# Altium project XMS0004.PrjPcb (part 2 of 3)

## Sheet ADC.SchDoc: xcore.ai Multi Channel Audio
size 408 x 287 mm; DocumentNumber: 4; Revision: 1V1; SheetNumber: 4; SheetTotal: 8
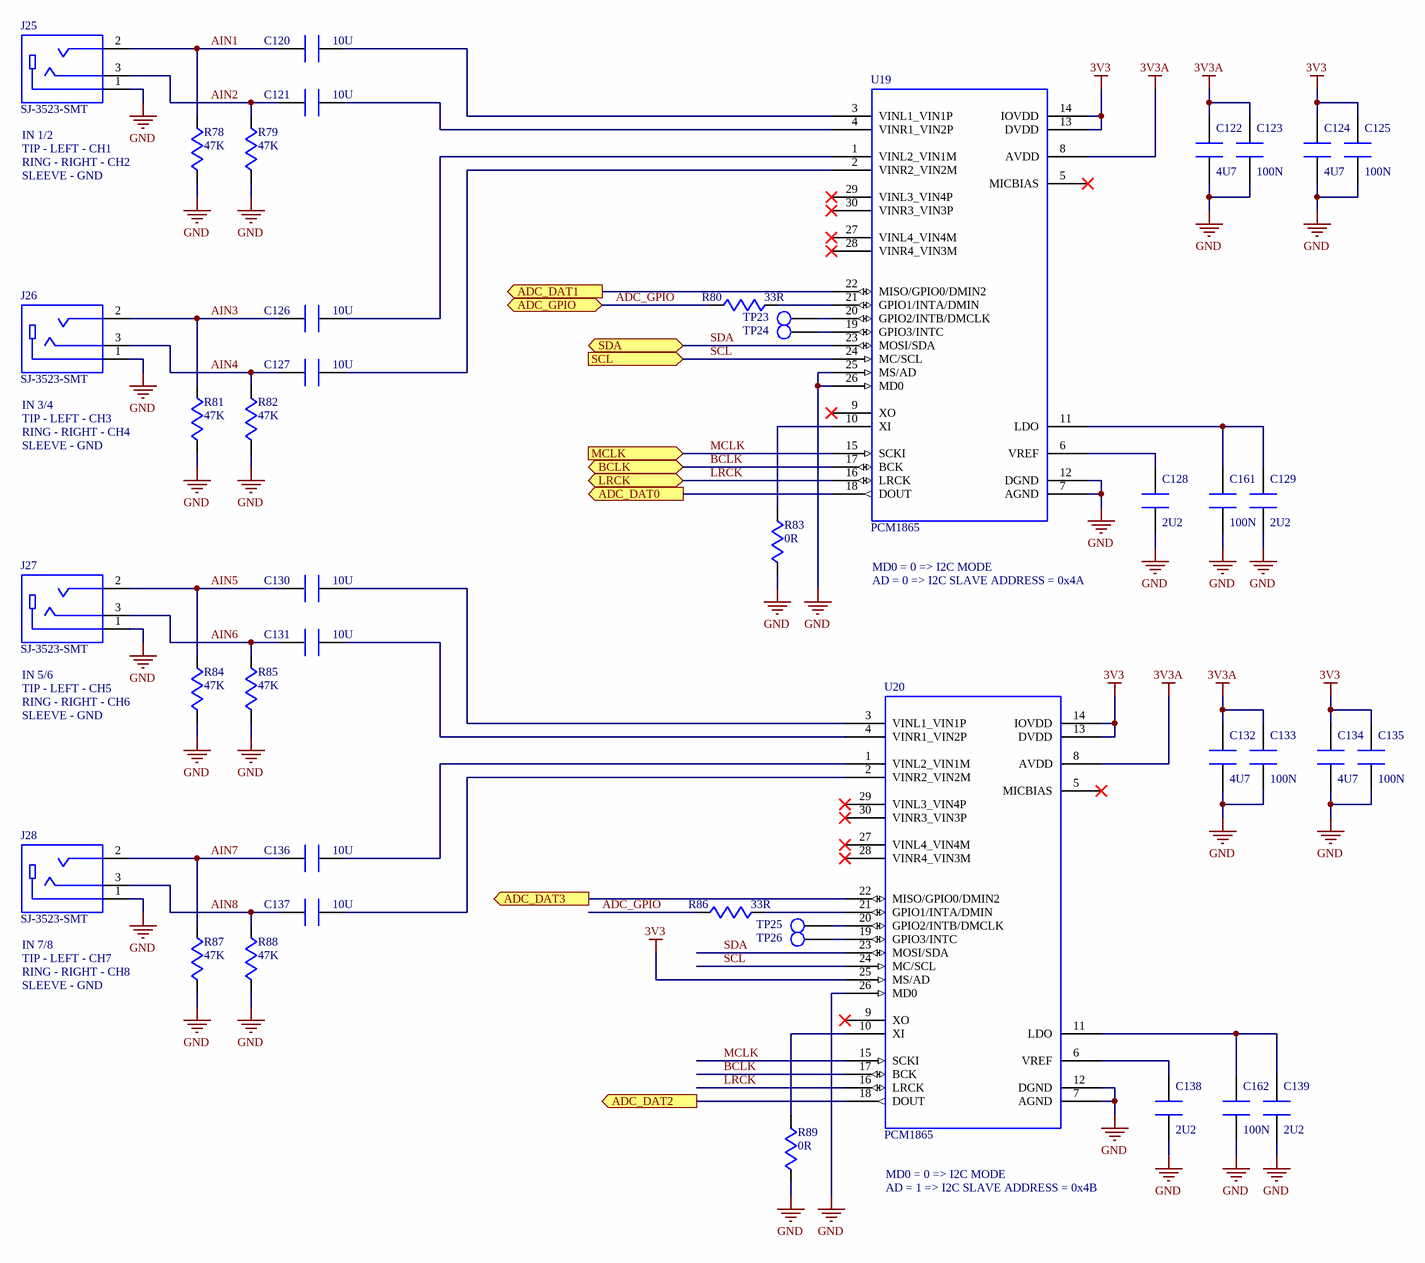
[diagram p4: ADC.SchDoc]

### Parts
C120  10U  [CAPC2012X145N]
C121  10U  [CAPC2012X145N]
C122  4U7  [CAPC1608X90N]
C123  100N  [CAPC1005X55N]
C124  4U7  [CAPC1608X90N]
C125  100N  [CAPC1005X55N]
C126  10U  [CAPC2012X145N]
C127  10U  [CAPC2012X145N]
C128  2U2  [CAPC1608X90N]
C129  2U2  [CAPC1608X90N]
C130  10U  [CAPC2012X145N]
C131  10U  [CAPC2012X145N]
C132  4U7  [CAPC1608X90N]
C133  100N  [CAPC1005X55N]
C134  4U7  [CAPC1608X90N]
C135  100N  [CAPC1005X55N]
C136  10U  [CAPC2012X145N]
C137  10U  [CAPC2012X145N]
C138  2U2  [CAPC1608X90N]
C139  2U2  [CAPC1608X90N]
C161  100N  [CAPC1005X55N]
C162  100N  [CAPC1005X55N]
J25  SJ-3523-SMT  [CON_CUI_SJ3523]
J26  SJ-3523-SMT  [CON_CUI_SJ3523]
J27  SJ-3523-SMT  [CON_CUI_SJ3523]
J28  SJ-3523-SMT  [CON_CUI_SJ3523]
R78  47K  [RESC1608X55N]
R79  47K  [RESC1608X55N]
R80  33R  [RESC1608X55N]
R81  47K  [RESC1608X55N]
R82  47K  [RESC1608X55N]
R83  0R  [RESC1608X55N]
R84  47K  [RESC1608X55N]
R85  47K  [RESC1608X55N]
R86  33R  [RESC1608X55N]
R87  47K  [RESC1608X55N]
R88  47K  [RESC1608X55N]
R89  0R  [RESC1608X55N]
TP23  TESTPOINT  [TESTPOINT_SMD_1MM]  (value not drawn)  (no BOM)
TP24  TESTPOINT  [TESTPOINT_SMD_1MM]  (value not drawn)  (no BOM)
TP25  TESTPOINT  [TESTPOINT_SMD_1MM]  (value not drawn)  (no BOM)
TP26  TESTPOINT  [TESTPOINT_SMD_1MM]  (value not drawn)  (no BOM)
U19  PCM1865  [SOP30P50_780X640X120L62X20N]
U20  PCM1865  [SOP30P50_780X640X120L62X20N]

### Ports
ADC_DAT0 (out), ADC_DAT1 (out), ADC_DAT2 (out), ADC_DAT3 (out), ADC_GPIO (bidir), BCLK (bidir), LRCK (bidir), MCLK (in), SCL (in), SDA (bidir)

### Nets
3V3: C124.1 C125.1 C134.1 C135.1 U19.13(DVDD) U19.14(IOVDD) U20.13(DVDD) U20.14(IOVDD) U20.25(MS/AD)
3V3A: C122.1 C123.1 C132.1 C133.1 U19.8(AVDD) U20.8(AVDD)
GND: C122.2 C123.2 C124.2 C125.2 C128.2 C129.2 C132.2 C133.2 C134.2 C135.2 C138.2 C139.2 C161.2 C162.2 J25.1 J26.1 J27.1 J28.1 R78.1 R79.1 R81.1 R82.1 R83.2 R84.1 R85.1 R87.1 R88.1 R89.2 U19.7(AGND) U19.12(DGND) U19.25(MS/AD) U19.26(MD0) U20.7(AGND) U20.12(DGND) U20.26(MD0)
ADC_D0: U19.18(DOUT) ; port ADC_DAT0
ADC_D1: U19.22(MISO/GPIO0/DMIN2) ; port ADC_DAT1
ADC_D2: U20.18(DOUT) ; port ADC_DAT2
ADC_D3: U20.22(MISO/GPIO0/DMIN2) ; port ADC_DAT3
ADC_GPIO: R80.1 R86.1 ; port ADC_GPIO
AIN1: C120.1 J25.2 R78.2
AIN2: C121.1 J25.3 R79.2
AIN3: C126.1 J26.2 R81.2
AIN4: C127.1 J26.3 R82.2
AIN5: C130.1 J27.2 R84.2
AIN6: C131.1 J27.3 R85.2
AIN7: C136.1 J28.2 R87.2
AIN8: C137.1 J28.3 R88.2
BCLK: U19.17(BCK) U20.17(BCK) ; port BCLK
LRCK: U19.16(LRCK) U20.16(LRCK) ; port LRCK
MCLK: U19.15(SCKI) U20.15(SCKI) ; port MCLK  [project net MCLK_ADC]
SCL: U19.24(MC/SCL) U20.24(MC/SCL) ; port SCL  [project net I2C0_SCL]
SDA: U19.23(MOSI/SDA) U20.23(MOSI/SDA) ; port SDA  [project net I2C0_SDA]
NetC120_2: C120.2 U19.3(VINL1_VIN1P)
NetC121_2: C121.2 U19.4(VINR1_VIN2P)
NetC126_2: C126.2 U19.1(VINL2_VIN1M)
NetC127_2: C127.2 U19.2(VINR2_VIN2M)
NetC128_1: C128.1 U19.6(VREF)
NetC129_1: C129.1 C161.1 U19.11(LDO)
NetC130_2: C130.2 U20.3(VINL1_VIN1P)
NetC131_2: C131.2 U20.4(VINR1_VIN2P)
NetC136_2: C136.2 U20.1(VINL2_VIN1M)
NetC137_2: C137.2 U20.2(VINR2_VIN2M)
NetC138_1: C138.1 U20.6(VREF)
NetC139_1: C139.1 C162.1 U20.11(LDO)
NetR80_2: R80.2 U19.21(GPIO1/INTA/DMIN)
NetR83_1: R83.1 U19.10(XI)
NetR86_2: R86.2 U20.21(GPIO1/INTA/DMIN)
NetR89_1: R89.1 U20.10(XI)
NetTP23_1: TP23.1 U19.20(GPIO2/INTB/DMCLK)
NetTP24_1: TP24.1 U19.19(GPIO3/INTC)
NetTP25_1: TP25.1 U20.20(GPIO2/INTB/DMCLK)
NetTP26_1: TP26.1 U20.19(GPIO3/INTC)

Not connected (* = marked no-connect by the designer): U19 5(MICBIAS)* 9(XO)* 27(VINL4_VIN4M)* 28(VINR4_VIN3M)* 29(VINL3_VIN4P)* 30(VINR3_VIN3P)*; U20 5(MICBIAS)* 9(XO)* 27(VINL4_VIN4M)* 28(VINR4_VIN3M)* 29(VINL3_VIN4P)* 30(VINR3_VIN3P)*

### Notes on the sheet
- IN 1/2
- TIP - LEFT - CH1
- RING - RIGHT - CH2
- SLEEVE - GND
- IN 3/4
- TIP - LEFT - CH3
- RING - RIGHT - CH4
- AD = 0 => I2C SLAVE ADDRESS = 0x4A
- MD0 = 0 => I2C MODE
- IN 5/6
- TIP - LEFT - CH5
- RING - RIGHT - CH6
- IN 7/8
- TIP - LEFT - CH7
- RING - RIGHT - CH8
- AD = 1 => I2C SLAVE ADDRESS = 0x4B
- Project Name
- Build
- Sheet Name
- Rev
- Date
- Sheet
- of

### Library data of the parts
C120 C121 C126 C127 C130 C131 C136 C137 = GEN-03-0048: CHIP CAPACITOR, CERAMIC, 10UF, 10V, 20%, X7R, 0805; Manufacturer: Murata; Manufacturer Part Number: GRM21BR71A106MA73L; Approx Volume Cost ($): 0.04; VALUE: 10U; Part Number: GEN-03-0048; Dielectric: X7R; Rated Voltage: 10V; Tolerance: 20%; Web Search Link: http://www.google.com/search?q=GRM21BR71A106MA73L
C122 C124 C132 C134 = STD-06-0151: CHIP CAPACITOR, CERAMIC, 4.7UF, 16V, 10%, X5R, 0603; Manufacturer: Murata; Manufacturer Part Number: GRM188R61C475KE11D; Approx Volume Cost ($): 0.084; VALUE: 4U7; Part Number: STD-06-0151; Dielectric: X5R; Rated Voltage: 16V; Tolerance: 10%; Web Search Link: http://www.google.com/search?q=GRM188R61C475KE11D
C123 C125 C133 C135 C161 C162 = STD-06-0048: as C62 on sheet Top Level; VALUE: 100N; Part Number: STD-06-0048; Dielectric: X7R; Rated Voltage: 16V; Tolerance: 10%; Web Search Link: http://www.google.com/search?q=CC0402KRX7R7BB104
C128 C129 C138 C139 = STD-06-0152: CHIP CAPACITOR, CERAMIC, 2.2UF, 16V, 10%, X5R, 0603; Manufacturer: Yageo; Manufacturer Part Number: CC0603KRX5R7BB225; Approx Volume Cost ($): 0.033; VALUE: 2U2; Part Number: STD-06-0152; Dielectric: X5R; Rated Voltage: 16V; Tolerance: 10%; Web Search Link: http://www.google.com/search?q=CC0603KRX5R7BB225
J25-J28 = GEN-01-0021: TRS jack, 3.5mm, SMD; Manufacturer: CUI; Approx Volume Cost ($): 0.51; VALUE: SJ-3523-SMT; Part Number: GEN-01-0021; Manufacturer Part Number: SJ-3523-SMT; Web Search Link: http://www.google.com/search?q=SJ-3523-SMT
R78 R79 R81 R82 R84 R85 R87 R88 = STD-02-0102: CHIP RESISTOR, 47K OHM, 0.1W, 1%, 0603; Manufacturer: Yageo; Manufacturer Part Number: RC0603FR-0747KL; Max Voltage: 50V; Max Power: 100mW; Temperature Coefficient: ±100ppm/°C; Approx Volume Cost ($): 0.002; VALUE: 47K; Part Number: STD-02-0102; Tolerance: 1%; Web Search Link: http://www.google.com/search?q=RC0603FR-0747KL
R80 R86 = STD-02-0026: as R12 on sheet Top Level; VALUE: 33R; Part Number: STD-02-0026; Tolerance: 1%; Web Search Link: http://www.google.com/search?q=RC0603FR-0733RL
R83 R89 = STD-02-0001: as R118 on sheet Top Level; VALUE: 0R; Part Number: STD-02-0001; Max Power: NA; Temperature Coefficient: NA; Web Search Link: http://www.google.com/search?q=RC0603JR-070RL
TP23-TP26 = GEN-24-0003: Testpoint, SMD, 1mm; Manufacturer: NA; VALUE: TESTPOINT; Part Number: GEN-24-0003; Manufacturer Part Number: NA; Approx Volume Cost ($): NA
U19 U20 = GEN-06-0022: Audio ADC, 4-Channel, 24 bit/192kHz, Single Ended or Differential, 110dB SNR, I2C/SPI Control, TSSOP30; Manufacturer: Texas Instruments; Manufacturer Part Number: PCM1865DBTR; Approx Volume Cost ($): 4; VALUE: PCM1865; Part Number: GEN-06-0022; Web Search Link: http://www.google.com/search?q=PCM1865

## Sheet DAC.SchDoc: xcore.ai Multi Channel Audio
size 408 x 287 mm; DocumentNumber: 3; Revision: 1V1; SheetNumber: 3; SheetTotal: 8
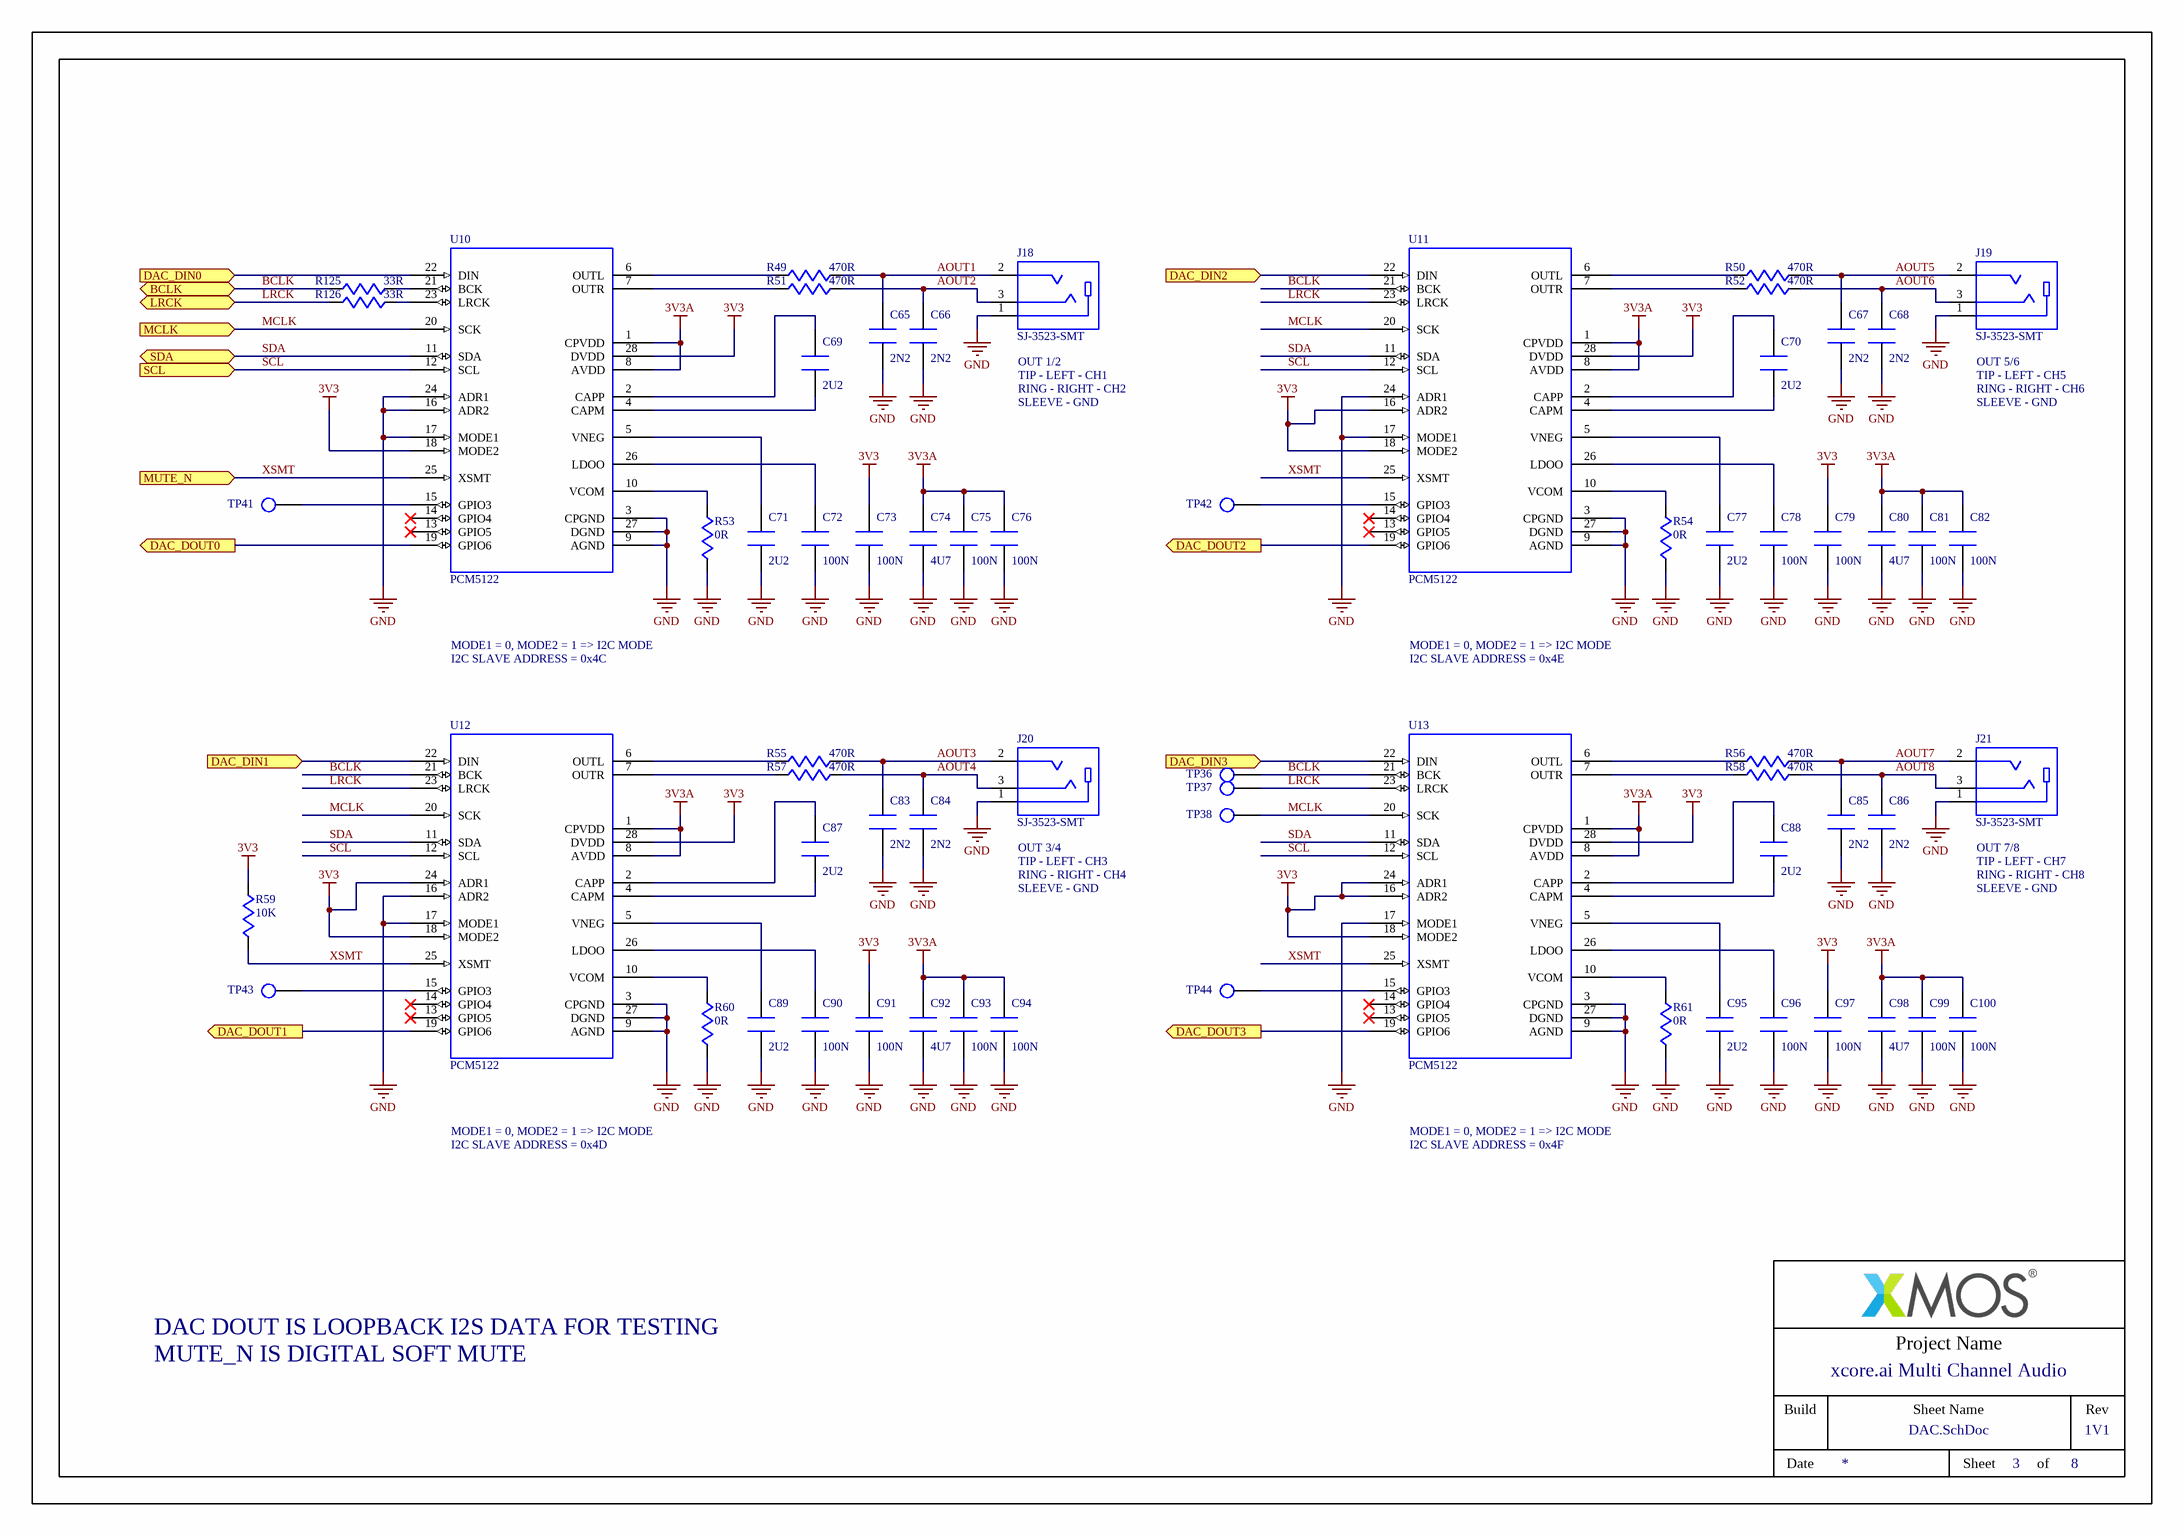
[diagram p5: DAC.SchDoc]

### Parts
C65  2N2  [CAPC1608X90N]
C66  2N2  [CAPC1608X90N]
C67  2N2  [CAPC1608X90N]
C68  2N2  [CAPC1608X90N]
C69  2U2  [CAPC1608X90N]
C70  2U2  [CAPC1608X90N]
C71  2U2  [CAPC1608X90N]
C72  100N  [CAPC1005X55N]
C73  100N  [CAPC1005X55N]
C74  4U7  [CAPC1608X90N]
C75  100N  [CAPC1005X55N]
C76  100N  [CAPC1005X55N]
C77  2U2  [CAPC1608X90N]
C78  100N  [CAPC1005X55N]
C79  100N  [CAPC1005X55N]
C80  4U7  [CAPC1608X90N]
C81  100N  [CAPC1005X55N]
C82  100N  [CAPC1005X55N]
C83  2N2  [CAPC1608X90N]
C84  2N2  [CAPC1608X90N]
C85  2N2  [CAPC1608X90N]
C86  2N2  [CAPC1608X90N]
C87  2U2  [CAPC1608X90N]
C88  2U2  [CAPC1608X90N]
C89  2U2  [CAPC1608X90N]
C90  100N  [CAPC1005X55N]
C91  100N  [CAPC1005X55N]
C92  4U7  [CAPC1608X90N]
C93  100N  [CAPC1005X55N]
C94  100N  [CAPC1005X55N]
C95  2U2  [CAPC1608X90N]
C96  100N  [CAPC1005X55N]
C97  100N  [CAPC1005X55N]
C98  4U7  [CAPC1608X90N]
C99  100N  [CAPC1005X55N]
C100  100N  [CAPC1005X55N]
J18  SJ-3523-SMT  [CON_CUI_SJ3523]
J19  SJ-3523-SMT  [CON_CUI_SJ3523]
J20  SJ-3523-SMT  [CON_CUI_SJ3523]
J21  SJ-3523-SMT  [CON_CUI_SJ3523]
R49  470R  [RESC1608X55N]
R50  470R  [RESC1608X55N]
R51  470R  [RESC1608X55N]
R52  470R  [RESC1608X55N]
R53  0R  [RESC1608X55N]
R54  0R  [RESC1608X55N]
R55  470R  [RESC1608X55N]
R56  470R  [RESC1608X55N]
R57  470R  [RESC1608X55N]
R58  470R  [RESC1608X55N]
R59  10K  [RESC1608X55N]
R60  0R  [RESC1608X55N]
R61  0R  [RESC1608X55N]
R125  33R  [RESC1608X55N]
R126  33R  [RESC1608X55N]
TP36  TESTPOINT  [TESTPOINT_SMD_0.9MM_L]  (value not drawn)  (no BOM)
TP37  TESTPOINT  [TESTPOINT_SMD_0.9MM_L]  (value not drawn)  (no BOM)
TP38  TESTPOINT  [TESTPOINT_SMD_0.9MM_L]  (value not drawn)  (no BOM)
TP41  TESTPOINT  [TESTPOINT_SMD_0.9MM_L]  (value not drawn)  (no BOM)
TP42  TESTPOINT  [TESTPOINT_SMD_0.9MM_L]  (value not drawn)  (no BOM)
TP43  TESTPOINT  [TESTPOINT_SMD_0.9MM_L]  (value not drawn)  (no BOM)
TP44  TESTPOINT  [TESTPOINT_SMD_0.9MM_L]  (value not drawn)  (no BOM)
U10  PCM5122  [SOP65P640X120-28N]
U11  PCM5122  [SOP65P640X120-28N]
U12  PCM5122  [SOP65P640X120-28N]
U13  PCM5122  [SOP65P640X120-28N]

### Ports
BCLK (bidir), DAC_DIN0 (in), DAC_DIN1 (in), DAC_DIN2 (in), DAC_DIN3 (in), DAC_DOUT0 (out), DAC_DOUT1 (out), DAC_DOUT2 (out), DAC_DOUT3 (out), LRCK (bidir), MCLK (in), MUTE_N (in), SCL (in), SDA (bidir)

### Nets
3V3: C73.1 C79.1 C91.1 C97.1 R59.2 U10.18(MODE2) U10.28(DVDD) U11.16(ADR2) U11.18(MODE2) U11.28(DVDD) U12.18(MODE2) U12.24(ADR1) U12.28(DVDD) U13.16(ADR2) U13.18(MODE2) U13.24(ADR1) U13.28(DVDD)
3V3A: C74.1 C75.1 C76.1 C80.1 C81.1 C82.1 C92.1 C93.1 C94.1 C98.1 C99.1 C100.1 U10.1(CPVDD) U10.8(AVDD) U11.1(CPVDD) U11.8(AVDD) U12.1(CPVDD) U12.8(AVDD) U13.1(CPVDD) U13.8(AVDD)
GND: C65.2 C66.2 C67.2 C68.2 C71.2 C72.2 C73.2 C74.2 C75.2 C76.2 C77.2 C78.2 C79.2 C80.2 C81.2 C82.2 C83.2 C84.2 C85.2 C86.2 C89.2 C90.2 C91.2 C92.2 C93.2 C94.2 C95.2 C96.2 C97.2 C98.2 C99.2 C100.2 J18.1 J19.1 J20.1 J21.1 R53.1 R54.1 R60.1 R61.1 U10.3(CPGND) U10.9(AGND) U10.16(ADR2) U10.17(MODE1) U10.24(ADR1) U10.27(DGND) U11.3(CPGND) U11.9(AGND) U11.17(MODE1) U11.24(ADR1) U11.27(DGND) U12.3(CPGND) U12.9(AGND) U12.16(ADR2) U12.17(MODE1) U12.27(DGND) U13.3(CPGND) U13.9(AGND) U13.17(MODE1) U13.27(DGND)
AOUT1: C65.1 J18.2 R49.2
AOUT2: C66.1 J18.3 R51.2
AOUT3: C83.1 J20.2 R55.2
AOUT4: C84.1 J20.3 R57.2
AOUT5: C67.1 J19.2 R50.2
AOUT6: C68.1 J19.3 R52.2
AOUT7: C85.1 J21.2 R56.2
AOUT8: C86.1 J21.3 R58.2
BCLK: R125.1 TP36.1 U11.21(BCK) U12.21(BCK) U13.21(BCK) ; port BCLK
DAC_D0: U10.22(DIN) ; port DAC_DIN0
DAC_D1: U12.22(DIN) ; port DAC_DIN1
DAC_D2: U11.22(DIN) ; port DAC_DIN2
DAC_D3: U13.22(DIN) ; port DAC_DIN3
I2S_DAC_LOOP_D0: U10.19(GPIO6) ; port DAC_DOUT0
I2S_DAC_LOOP_D1: U12.19(GPIO6) ; port DAC_DOUT1
I2S_DAC_LOOP_D2: U11.19(GPIO6) ; port DAC_DOUT2
I2S_DAC_LOOP_D3: U13.19(GPIO6) ; port DAC_DOUT3
LRCK: R126.1 TP37.1 U11.23(LRCK) U12.23(LRCK) U13.23(LRCK) ; port LRCK
MCLK: TP38.1 U10.20(SCK) U11.20(SCK) U12.20(SCK) U13.20(SCK) ; port MCLK  [project net MCLK_DAC]
SCL: U10.12(SCL) U11.12(SCL) U12.12(SCL) U13.12(SCL) ; port SCL  [project net I2C0_SCL]
SDA: U10.11(SDA) U11.11(SDA) U12.11(SDA) U13.11(SDA) ; port SDA  [project net I2C0_SDA]
XSMT: R59.1 U10.25(XSMT) U11.25(XSMT) U12.25(XSMT) U13.25(XSMT) ; port MUTE_N  [project net DAC_MUTE_N]
NetC69_1: C69.1 U10.2(CAPP)
NetC69_2: C69.2 U10.4(CAPM)
NetC70_1: C70.1 U11.2(CAPP)
NetC70_2: C70.2 U11.4(CAPM)
NetC71_1: C71.1 U10.5(VNEG)
NetC72_1: C72.1 U10.26(LDOO)
NetC77_1: C77.1 U11.5(VNEG)
NetC78_1: C78.1 U11.26(LDOO)
NetC87_1: C87.1 U12.2(CAPP)
NetC87_2: C87.2 U12.4(CAPM)
NetC88_1: C88.1 U13.2(CAPP)
NetC88_2: C88.2 U13.4(CAPM)
NetC89_1: C89.1 U12.5(VNEG)
NetC90_1: C90.1 U12.26(LDOO)
NetC95_1: C95.1 U13.5(VNEG)
NetC96_1: C96.1 U13.26(LDOO)
NetR49_1: R49.1 U10.6(OUTL)
NetR50_1: R50.1 U11.6(OUTL)
NetR51_1: R51.1 U10.7(OUTR)
NetR52_1: R52.1 U11.7(OUTR)
NetR53_2: R53.2 U10.10(VCOM)
NetR54_2: R54.2 U11.10(VCOM)
NetR55_1: R55.1 U12.6(OUTL)
NetR56_1: R56.1 U13.6(OUTL)
NetR57_1: R57.1 U12.7(OUTR)
NetR58_1: R58.1 U13.7(OUTR)
NetR60_2: R60.2 U12.10(VCOM)
NetR61_2: R61.2 U13.10(VCOM)
NetR125_2: R125.2 U10.21(BCK)
NetR126_2: R126.2 U10.23(LRCK)
NetTP41_1: TP41.1 U10.15(GPIO3)
NetTP42_1: TP42.1 U11.15(GPIO3)
NetTP43_1: TP43.1 U12.15(GPIO3)
NetTP44_1: TP44.1 U13.15(GPIO3)

Not connected (* = marked no-connect by the designer): U10 13(GPIO5)* 14(GPIO4)*; U11 13(GPIO5)* 14(GPIO4)*; U12 13(GPIO5)* 14(GPIO4)*; U13 13(GPIO5)* 14(GPIO4)*

### Notes on the sheet
- (near J18) OUT 1/2
- TIP - LEFT - CH1
- RING - RIGHT - CH2
- SLEEVE - GND
- (near J19) OUT 5/6
- TIP - LEFT - CH5
- RING - RIGHT - CH6
- I2C SLAVE ADDRESS = 0x4C
- MODE1 = 0, MODE2 = 1 => I2C MODE
- I2C SLAVE ADDRESS = 0x4E
- (near J20) OUT 3/4
- TIP - LEFT - CH3
- RING - RIGHT - CH4
- (near J21) OUT 7/8
- TIP - LEFT - CH7
- RING - RIGHT - CH8
- I2C SLAVE ADDRESS = 0x4D
- I2C SLAVE ADDRESS = 0x4F
- DAC DOUT IS LOOPBACK I2S DATA FOR TESTING
- MUTE_N IS DIGITAL SOFT MUTE
- Project Name
- Build
- Sheet Name
- Rev
- Date
- Sheet
- of

### Library data of the parts
C65-C68 C83-C86 = STD-06-0063: CHIP CAPACITOR, CERAMIC, 2.2NF, 50V, 5%, NP0, 0603; Manufacturer: Murata; Manufacturer Part Number: GRM1885C1H222JA01D; Approx Volume Cost ($): 0.01; VALUE: 2N2; Part Number: STD-06-0063; Dielectric: NP0; Rated Voltage: 50V; Tolerance: 5%; Web Search Link: http://www.google.com/search?q=GRM1885C1H222JA01D
C69-C71 C77 C87-C89 C95 = STD-06-0152: as C128 on sheet ADC; VALUE: 2U2; Part Number: STD-06-0152; Dielectric: X5R; Rated Voltage: 16V; Tolerance: 10%; Web Search Link: http://www.google.com/search?q=CC0603KRX5R7BB225
C72 C73 C75 C76 C78 C79 C81 C82 C90 C91 C93 C94 C96 C97 C99 C100 = STD-06-0048: as C62 on sheet Top Level; VALUE: 100N; Part Number: STD-06-0048; Dielectric: X7R; Rated Voltage: 16V; Tolerance: 10%; Web Search Link: http://www.google.com/search?q=CC0402KRX7R7BB104
C74 C80 C92 C98 = STD-06-0151: as C122 on sheet ADC; VALUE: 4U7; Part Number: STD-06-0151; Dielectric: X5R; Rated Voltage: 16V; Tolerance: 10%; Web Search Link: http://www.google.com/search?q=GRM188R61C475KE11D
J18-J21 = GEN-01-0021: as J25 on sheet ADC; VALUE: SJ-3523-SMT; Part Number: GEN-01-0021; Manufacturer Part Number: SJ-3523-SMT; Web Search Link: http://www.google.com/search?q=SJ-3523-SMT
R49-R52 R55-R58 = STD-02-0054: as R33 on sheet Top Level; VALUE: 470R; Part Number: STD-02-0054; Tolerance: 1%; Web Search Link: http://www.google.com/search?q=RC0603FR-07470RL
R53 R54 R60 R61 = STD-02-0001: as R118 on sheet Top Level; VALUE: 0R; Part Number: STD-02-0001; Max Power: NA; Temperature Coefficient: NA; Web Search Link: http://www.google.com/search?q=RC0603JR-070RL
R59 = STD-02-0086: as R23 on sheet Top Level; VALUE: 10K; Part Number: STD-02-0086; Tolerance: 1%; Web Search Link: http://www.google.com/search?q=RC0603FR-0710KL
R125 R126 = STD-02-0026: as R12 on sheet Top Level; VALUE: 33R; Part Number: STD-02-0026; Tolerance: 1%; Web Search Link: http://www.google.com/search?q=RC0603FR-0733RL
TP36-TP38 TP41-TP44 = GEN-24-0019: Testpoint, SMD, 0.9mm; Manufacturer: NA; VALUE: TESTPOINT; Part Number: GEN-24-0019; Manufacturer Part Number: NA; Approx Volume Cost ($): NA
U10-U13 = GEN-06-0001: Stereo Audio DAC, 32 bit/384kHz, 112dB SNR, PLL, 2Vrms Output, TSSOP28; Manufacturer: Texas Instruments; Manufacturer Part Number: PCM5122PW; Approx Volume Cost ($): 3.3; VALUE: PCM5122; Part Number: GEN-06-0001; Web Search Link: http://www.google.com/search?q=PCM5122PW

## Sheet XTAG4.SchDoc: xcore.ai Multi Channel Audio
size 584 x 408 mm; DocumentNumber: 7; Revision: 1V1; SheetNumber: 7; SheetTotal: 8
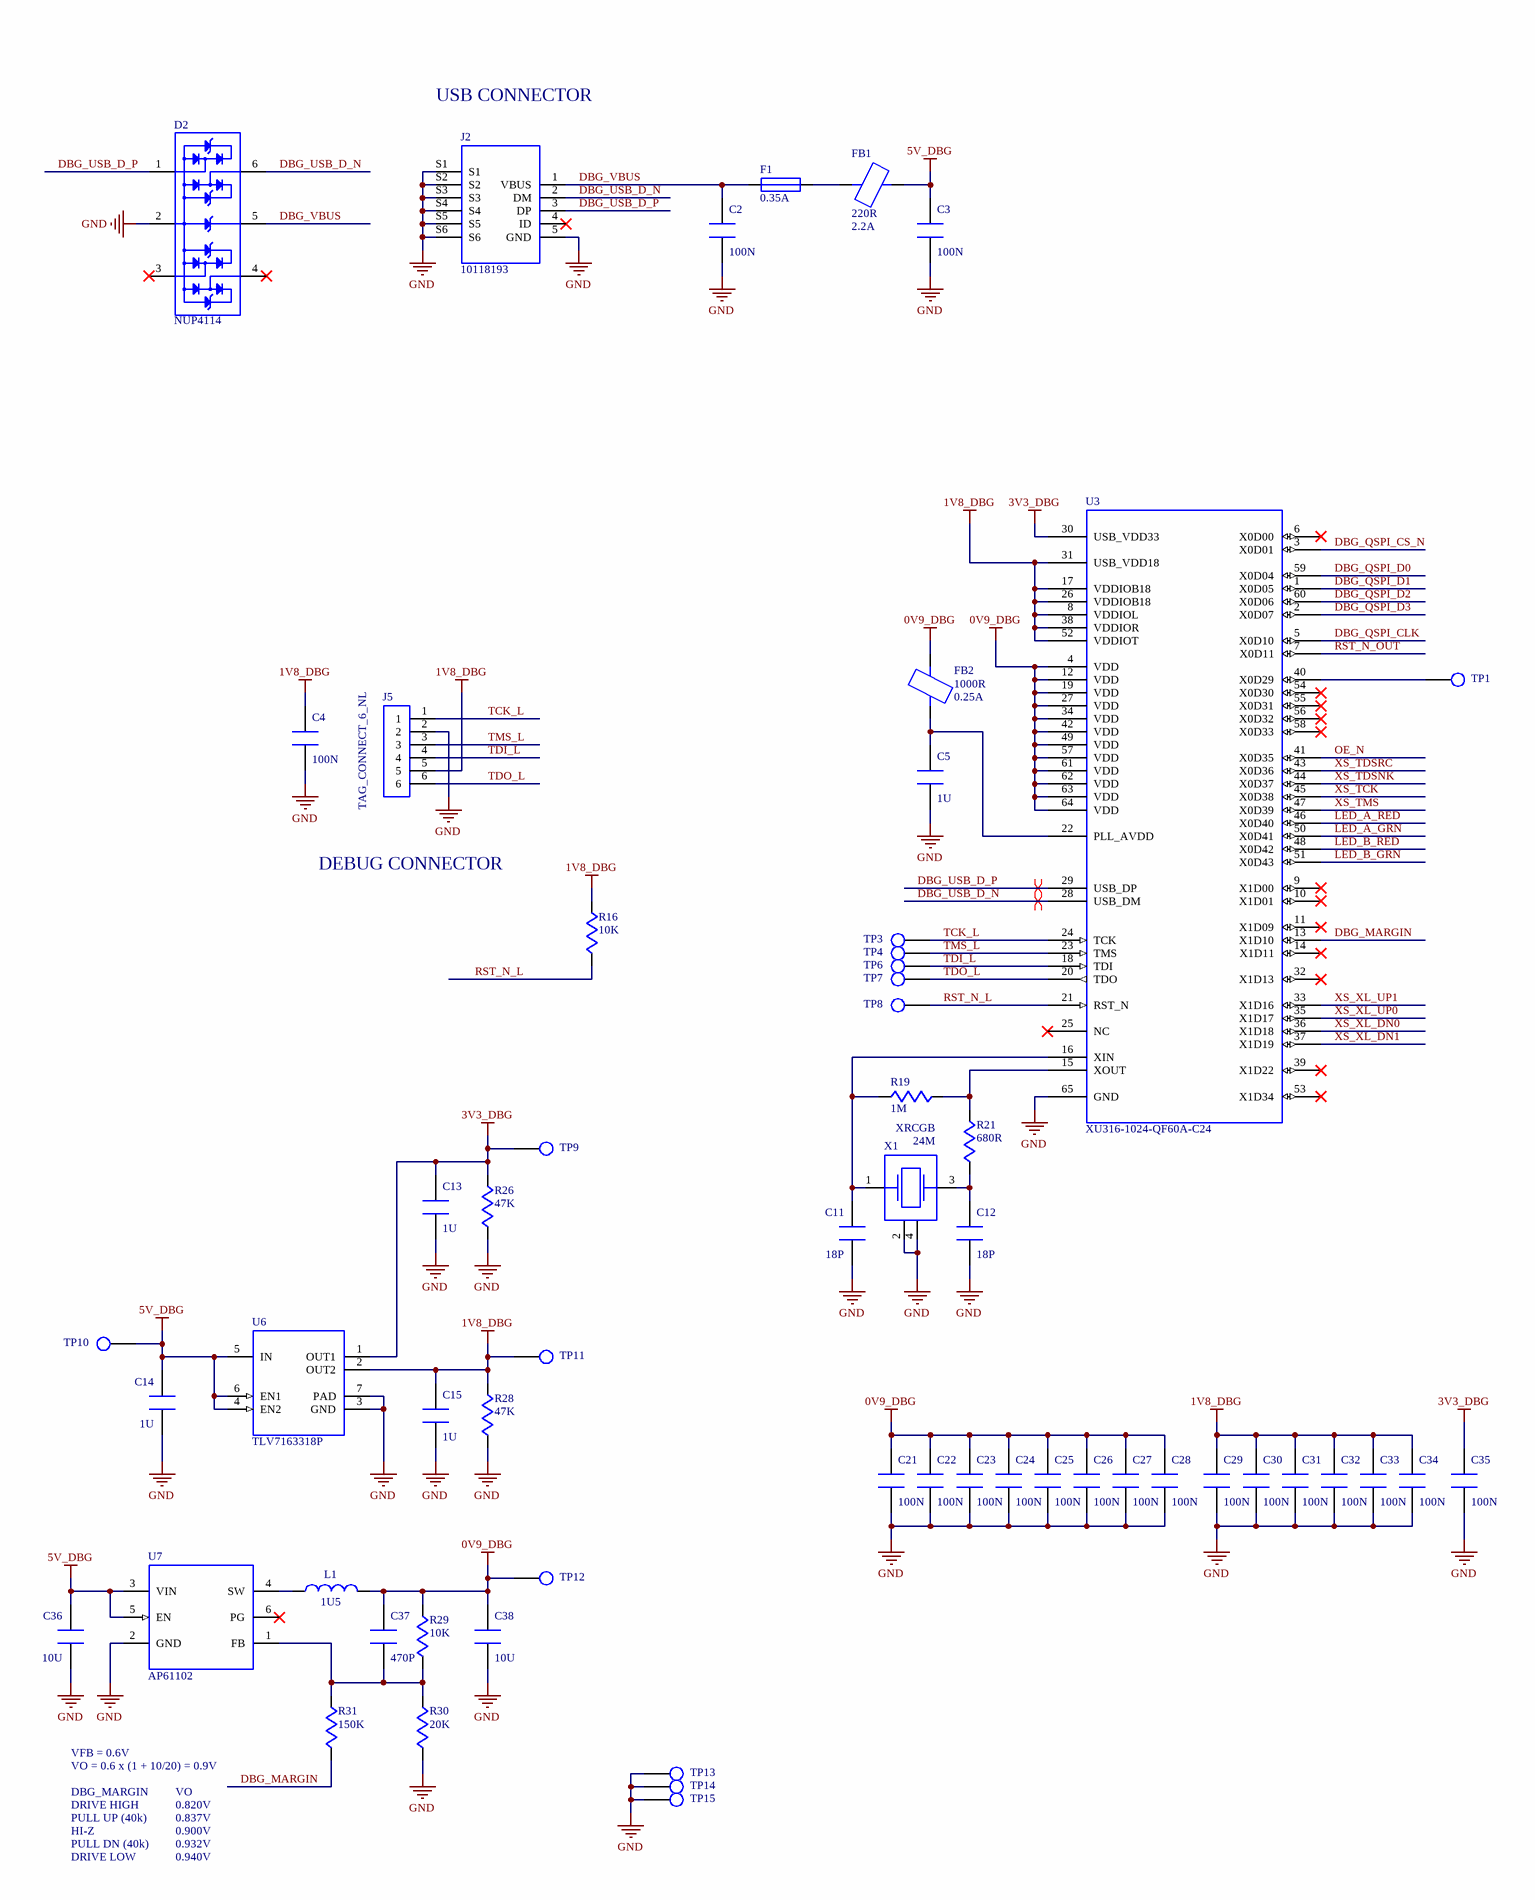
[diagram p6: XTAG4.SchDoc, left]
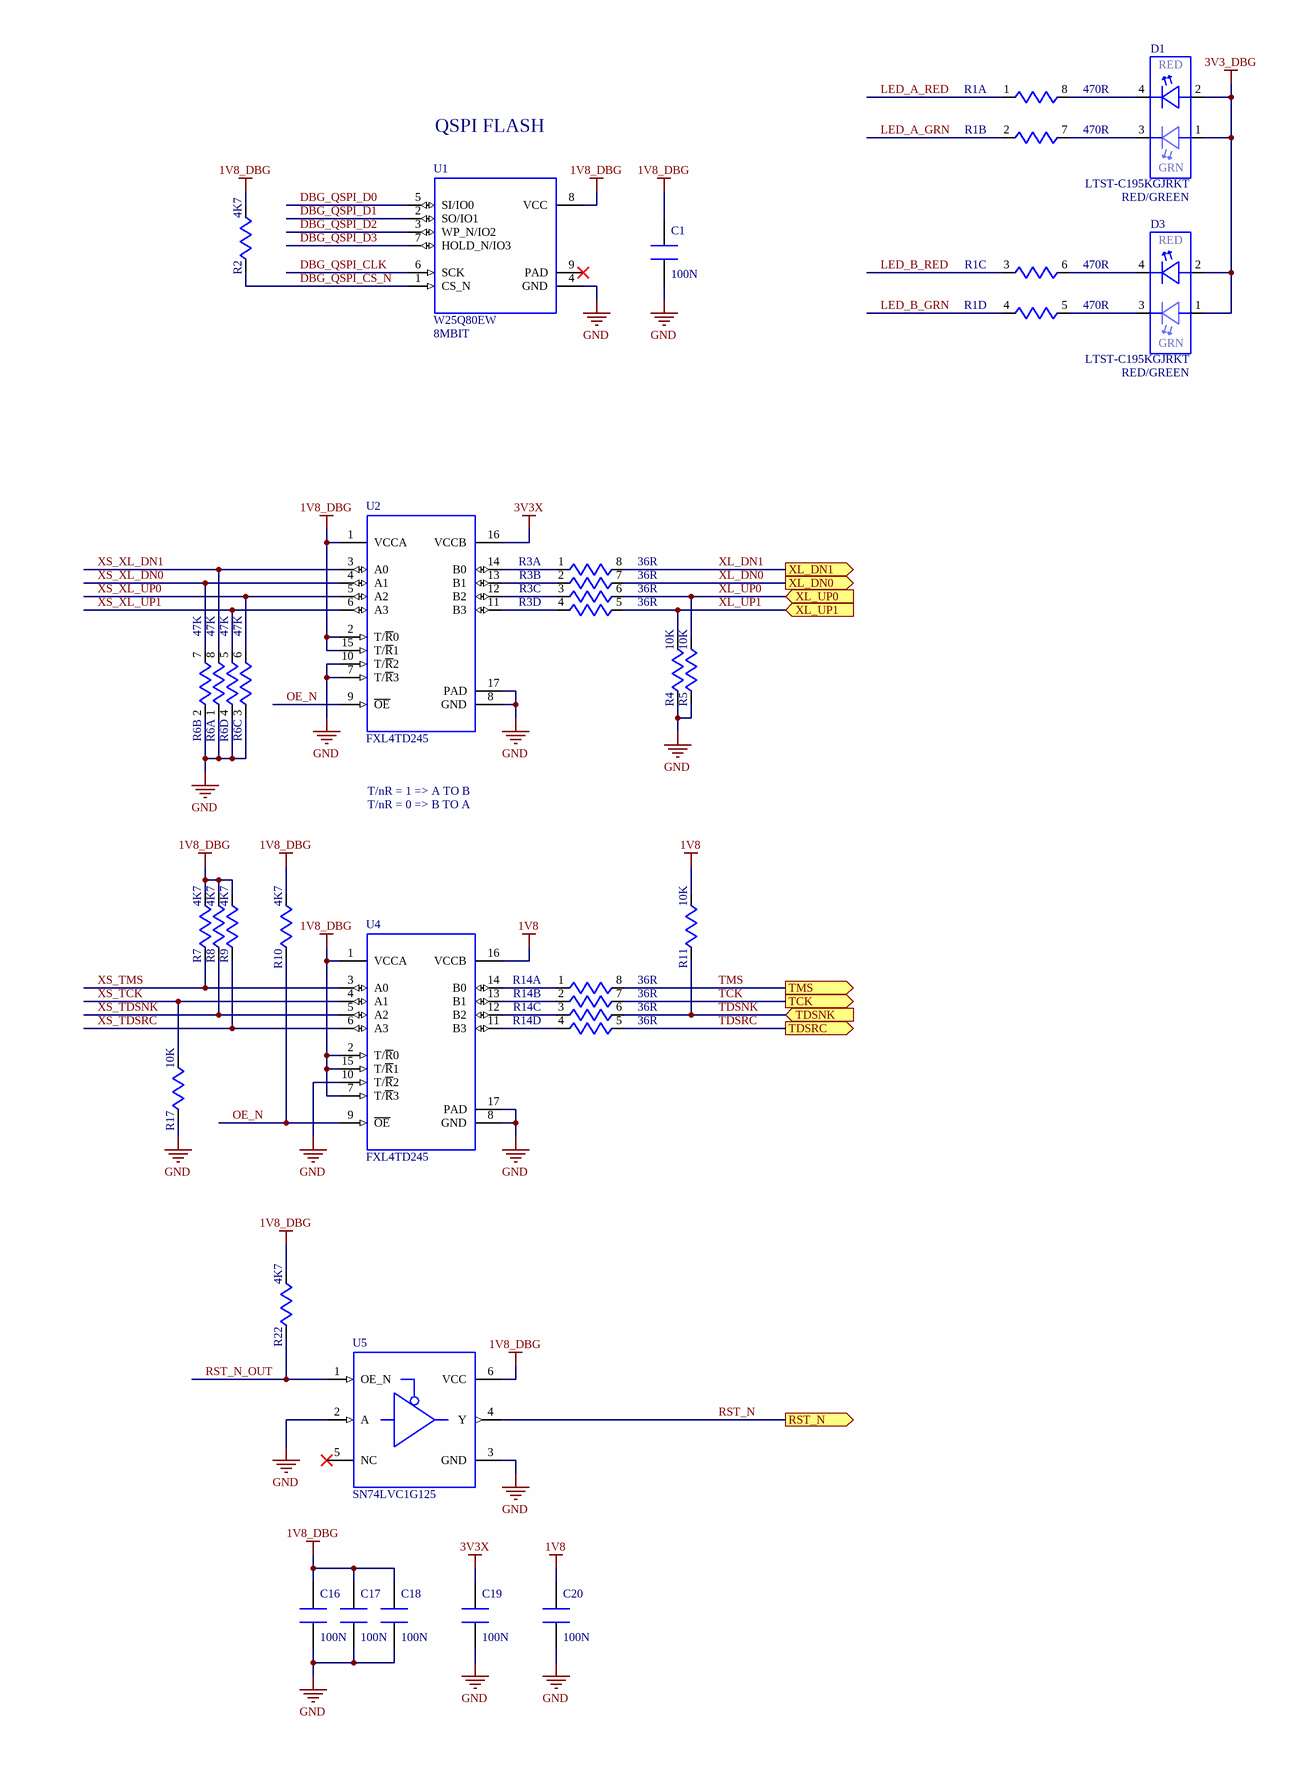
[diagram p7: XTAG4.SchDoc, right]

### Parts
C1  100N  [CAPC1005X55N]
C2  100N  [CAPC1005X55N]
C3  100N  [CAPC1005X55N]
C4  100N  [CAPC1005X55N]
C5  1U  [CAPC1005X55N]
C11  18P  [CAPC1005X55N]
C12  18P  [CAPC1005X55N]
C13  1U  [CAPC1005X55N]
C14  1U  [CAPC1005X55N]
C15  1U  [CAPC1005X55N]
C16  100N  [CAPC1005X55N]
C17  100N  [CAPC1005X55N]
C18  100N  [CAPC1005X55N]
C19  100N  [CAPC1005X55N]
C20  100N  [CAPC1005X55N]
C21  100N  [CAPC1005X55N]
C22  100N  [CAPC1005X55N]
C23  100N  [CAPC1005X55N]
C24  100N  [CAPC1005X55N]
C25  100N  [CAPC1005X55N]
C26  100N  [CAPC1005X55N]
C27  100N  [CAPC1005X55N]
C28  100N  [CAPC1005X55N]
C29  100N  [CAPC1005X55N]
C30  100N  [CAPC1005X55N]
C31  100N  [CAPC1005X55N]
C32  100N  [CAPC1005X55N]
C33  100N  [CAPC1005X55N]
C34  100N  [CAPC1005X55N]
C35  100N  [CAPC1005X55N]
C36  10U  [CAPC1608X90N]
C37  470P  [CAPC1005X55N]
C38  10U  [CAPC1608X90N]
D1  LTST-C195KGJRKT  Colour: RED/GREEN  [LED_LITEON_LTST_C195KGJRKT]
D2  NUP4114  [SOT65P210X110-6N]
D3  LTST-C195KGJRKT  Colour: RED/GREEN  [LED_LITEON_LTST_C195KGJRKT]
F1  0.35A  [FUSC215X135X75L40N]
FB1  220R  Rated Current: 2.2A  [INDC1608X95N]
FB2  1000R  Rated Current: 0.25A  [INDC1005X55N]
J2  10118193  [CON_FCI_10118193]
J5  TAG_CONNECT_6_NL  [CON_TAG_CONNECT_6_NOLEG]  (no BOM)
L1  1U5  [INDC2520X120N]
R1  470R  [RESCAXS50P200X100X55-8N]  (parts A,B,C,D of 4)
R2  4K7  [RESC1005X40N]
R3  36R  [RESCAXS50P200X100X55-8N]  (parts A,B,C,D of 4)
R4  10K  [RESC1005X40N]
R5  10K  [RESC1005X40N]
R6  47K  [RESCAXS50P200X100X55-8N]  (parts A,B,C,D of 4)
R7  4K7  [RESC1005X40N]
R8  4K7  [RESC1005X40N]
R9  4K7  [RESC1005X40N]
R10  4K7  [RESC1005X40N]
R11  10K  [RESC1005X40N]
R14  36R  [RESCAXS50P200X100X55-8N]  (parts A,B,C,D of 4)
R16  10K  [RESC1005X40N]
R17  10K  [RESC1005X40N]
R19  1M  [RESC1005X40N]
R21  680R  [RESC1005X40N]
R22  4K7  [RESC1005X40N]
R26  47K  [RESC1005X40N]
R28  47K  [RESC1005X40N]
R29  10K  [RESC1005X40N]
R30  20K  [RESC1005X40N]
R31  150K  [RESC1005X40N]
TP1  TESTPOINT  [TESTPOINT_SMD_1MM]  (value not drawn)  (no BOM)
TP3  TESTPOINT  [TESTPOINT_SMD_1.2MM]  (value not drawn)  (no BOM)
TP4  TESTPOINT  [TESTPOINT_SMD_1.2MM]  (value not drawn)  (no BOM)
TP6  TESTPOINT  [TESTPOINT_SMD_1.2MM]  (value not drawn)  (no BOM)
TP7  TESTPOINT  [TESTPOINT_SMD_1.2MM]  (value not drawn)  (no BOM)
TP8  TESTPOINT  [TESTPOINT_SMD_1.2MM]  (value not drawn)  (no BOM)
TP9  TESTPOINT  [TESTPOINT_SMD_1.2MM]  (value not drawn)  (no BOM)
TP10  TESTPOINT  [TESTPOINT_SMD_1.2MM]  (value not drawn)  (no BOM)
TP11  TESTPOINT  [TESTPOINT_SMD_1.2MM]  (value not drawn)  (no BOM)
TP12  TESTPOINT  [TESTPOINT_SMD_1.2MM]  (value not drawn)  (no BOM)
TP13  TESTPOINT  [TESTPOINT_SMD_1.2MM]  (value not drawn)  (no BOM)
TP14  TESTPOINT  [TESTPOINT_SMD_1.2MM]  (value not drawn)  (no BOM)
TP15  TESTPOINT  [TESTPOINT_SMD_1.2MM]  (value not drawn)  (no BOM)
U1  W25Q80EW  Memory Size: 8MBIT  [SON9P50_200X300X60L45X25T160X20N]
U2  FXL4TD245  [IC_NXP_DHVQFN16]
U3  XU316-1024-QF60A-C24  [IC_XMOS_PX_QFN60A_NEWPADDLE]
U4  FXL4TD245  [IC_NXP_DHVQFN16]
U5  SN74LVC1G125  [TI_R_PUSON_N6]
U6  TLV7163318P  [TI_S_PX2SON_N6]
U7  AP61102  [ICSOFL6P50_160X160X60L30X21N]
X1  XRCGB  FREQUENCY: 24M  [OSCCC200X160X70N]

### Ports
RST_N (out), TCK (out), TDSNK (in), TDSRC (out), TMS (out), XL_DN0 (out), XL_DN1 (out), XL_UP0 (in), XL_UP1 (in)

### Nets
0V9_DBG: C21.1 C22.1 C23.1 C24.1 C25.1 C26.1 C27.1 C28.1 C37.1 C38.1 FB2.2 L1.2 R29.2 TP12.1 U3.4(VDD) U3.12(VDD) U3.19(VDD) U3.27(VDD) U3.34(VDD) U3.42(VDD) U3.49(VDD) U3.57(VDD) U3.61(VDD) U3.62(VDD) U3.63(VDD) U3.64(VDD)
1V8: C20.1 R11.2 U4.16(VCCB)
1V8_DBG: C1.1 C4.1 C15.1 C16.1 C17.1 C18.1 C29.1 C30.1 C31.1 C32.1 C33.1 C34.1 J5.5 R2.2 R7.2 R8.2 R9.2 R10.2 R16.2 R22.2 R28.2 TP11.1 U1.8(VCC) U2.1(VCCA) U2.2(T/~{R}0) U2.15(T/~{R}1) U3.8(VDDIOL) U3.17(VDDIOB18) U3.26(VDDIOB18) U3.31(USB_VDD18) U3.38(VDDIOR) U3.52(VDDIOT) U4.1(VCCA) U4.2(T/~{R}0) U4.7(T/~{R}3) U4.15(T/~{R}1) U5.6(VCC) U6.2(OUT2)
3V3_DBG: C13.1 C35.1 D1.1(GRN_A) D1.2(RED_A) D3.1(GRN_A) D3.2(RED_A) R26.2 TP9.1 U3.30(USB_VDD33) U6.1(OUT1)
3V3X: C19.1 U2.16(VCCB)
5V_DBG: C3.1 C14.1 C36.1 FB1.2 TP10.1 U6.4(EN2) U6.5(IN) U6.6(EN1) U7.3(VIN) U7.5(EN)
GND: C1.2 C2.2 C3.2 C4.2 C5.2 C11.2 C12.2 C13.2 C14.2 C15.2 C16.2 C17.2 C18.2 C19.2 C20.2 C21.2 C22.2 C23.2 C24.2 C25.2 C26.2 C27.2 C28.2 C29.2 C30.2 C31.2 C32.2 C33.2 C34.2 C35.2 C36.2 C38.2 D2.2 J2.5(GND) J2.S1 J2.S2 J2.S3 J2.S4 J2.S5 J2.S6 J5.2 R4.1 R5.1 R6.1 R6.2 R6.3 R6.4 R17.1 R26.1 R28.1 R30.1 TP13.1 TP14.1 TP15.1 U1.4(GND) U2.7(T/~{R}3) U2.8(GND) U2.10(T/~{R}2) U2.17(PAD) U3.65(GND) U4.8(GND) U4.10(T/~{R}2) U4.17(PAD) U5.2(A) U5.3(GND) U6.3(GND) U6.7(PAD) U7.2(GND) X1.2(CASE_2) X1.4(CASE_4)
DBG_MARGIN: R31.1 U3.13(X1D10)
DBG_QSPI_CLK: U1.6(SCK) U3.5(X0D10)
DBG_QSPI_CS_N: R2.1 U1.1(CS_N) U3.3(X0D01)
DBG_QSPI_D0: U1.5(SI/IO0) U3.59(X0D04)
DBG_QSPI_D1: U1.2(SO/IO1) U3.1(X0D05)
DBG_QSPI_D2: U1.3(WP_N/IO2) U3.60(X0D06)
DBG_QSPI_D3: U1.7(HOLD_N/IO3) U3.2(X0D07)
DBG_USB_D_N: D2.6 J2.2(DM) U3.28(USB_DM)
DBG_USB_D_P: D2.1 J2.3(DP) U3.29(USB_DP)
DBG_VBUS: C2.1 D2.5 F1.1(T1) J2.1(VBUS)
LED_A_GRN: R1.2 U3.50(X0D41)
LED_A_RED: R1.1 U3.46(X0D40)
LED_B_GRN: R1.4 U3.51(X0D43)
LED_B_RED: R1.3 U3.48(X0D42)
OE_N: R10.1 U2.9(~{OE}) U3.41(X0D35) U4.9(~{OE})
RST_N: U5.4(Y) ; port RST_N
RST_N_L: R16.1 TP8.1 U3.21(RST_N)
RST_N_OUT: R22.1 U3.7(X0D11) U5.1(OE_N)
TCK: R14.7 ; port TCK
TCK_L: J5.1 TP3.1 U3.24(TCK)
TDI_L: J5.4 TP6.1 U3.18(TDI)
TDO_L: J5.6 TP7.1 U3.20(TDO)
TDSNK: R11.1 R14.6 ; port TDSNK  [project net TDO]
TDSRC: R14.5 ; port TDSRC  [project net TDI]
TMS: R14.8 ; port TMS
TMS_L: J5.3 TP4.1 U3.23(TMS)
XL_DN0: R3.7 ; port XL_DN0
XL_DN1: R3.8 ; port XL_DN1
XL_UP0: R3.6 R5.2 ; port XL_UP0
XL_UP1: R3.5 R4.2 ; port XL_UP1
XS_TCK: R17.2 U3.45(X0D38) U4.4(A1)
XS_TDSNK: R8.1 U3.44(X0D37) U4.5(A2)
XS_TDSRC: R9.1 U3.43(X0D36) U4.6(A3)
XS_TMS: R7.1 U3.47(X0D39) U4.3(A0)
XS_XL_DN0: R6.7 U2.4(A1) U3.36(X1D18)
XS_XL_DN1: R6.8 U2.3(A0) U3.37(X1D19)
XS_XL_UP0: R6.6 U2.5(A2) U3.35(X1D17)
XS_XL_UP1: R6.5 U2.6(A3) U3.33(X1D16)
NetC5_1: C5.1 FB2.1 U3.22(PLL_AVDD)
NetC11_1: C11.1 R19.1 U3.16(XIN) X1.1(A)
NetC12_1: C12.1 R21.1 X1.3(B)
NetC37_2: C37.2 R29.1 R30.2 R31.2 U7.1(FB)
NetD1_3: D1.3(GRN_K) R1.7
NetD1_4: D1.4(RED_K) R1.8
NetD3_3: D3.3(GRN_K) R1.5
NetD3_4: D3.4(RED_K) R1.6
NetF1_2: F1.2(T2) FB1.1
NetL1_1: L1.1 U7.4(SW)
NetR3_1: R3.1 U2.14(B0)
NetR3_2: R3.2 U2.13(B1)
NetR3_3: R3.3 U2.12(B2)
NetR3_4: R3.4 U2.11(B3)
NetR14_1: R14.1 U4.14(B0)
NetR14_2: R14.2 U4.13(B1)
NetR14_3: R14.3 U4.12(B2)
NetR14_4: R14.4 U4.11(B3)
NetR19_2: R19.2 R21.2 U3.15(XOUT)
NetTP1_1: TP1.1 U3.40(X0D29)

Not connected (* = marked no-connect by the designer): D2 3* 4*; J2 4(ID)*; U1 9(PAD)*; U3 6(X0D00)* 9(X1D00)* 10(X1D01)* 11(X1D09)* 14(X1D11)* 25(NC)* 32(X1D13)* 39(X1D22)* 53(X1D34)* 54(X0D30)* 55(X0D31)* 56(X0D32)* 58(X0D33)*; U5 5(NC)*; U7 6(PG)*

### Layout directives
differential pair; differential pair class USB: DBG_USB_D_N, DBG_USB_D_P

### Notes on the sheet
- USB CONNECTOR
- QSPI FLASH
- T/nR = 1 => A TO B
- T/nR = 0 => B TO A
- DEBUG CONNECTOR
- VFB = 0.6V
- VO = 0.6 x (1 + 10/20) = 0.9V
- DBG_MARGIN
- VO
- HI-Z
- PULL DN (40k)
- PULL UP (40k)
- DRIVE LOW
- DRIVE HIGH
- 0.900V
- 0.932V
- 0.837V
- 0.940V
- 0.820V
- Project Name
- Build
- Sheet Name
- Rev
- Date
- Sheet
- of
- (in symbol GEN-17-0007) RED; GRN

### Library data of the parts
C1-C4 C16-C35 = STD-06-0048: CHIP CAPACITOR, CERAMIC, 100NF, 16V, 10%, X7R, 0402; Manufacturer: Yageo; Manufacturer Part Number: CC0402KRX7R7BB104; Approx Volume Cost ($): 0.003; VALUE: 100N; Part Number: STD-06-0048; Dielectric: X7R; Rated Voltage: 16V; Tolerance: 10%
C5 C13-C15 = STD-06-0140: CHIP CAPACITOR, CERAMIC, 1.0UF, 16V, 10%, X5R, 0402; Manufacturer: Murata; Manufacturer Part Number: GRM155R61C105MA12D; Tolerance: 20%; Approx Volume Cost ($): 0.011; VALUE: 1U; Part Number: STD-06-0140; Dielectric: X5R; Rated Voltage: 16V
C11 C12 = STD-06-0016: CHIP CAPACITOR, CERAMIC, 18PF, 50V, 5%, NP0, 0402; Manufacturer: Yageo; Manufacturer Part Number: CC0402JRNPO9BN180; Approx Volume Cost ($): 0.003; VALUE: 18P; Part Number: STD-06-0016; Dielectric: NP0; Rated Voltage: 50V; Tolerance: 5%
C36 C38 = GEN-03-0043: CHIP CAPACITOR, CERAMIC, 10UF, 10V, 20%, X5R, 0603; Manufacturer: Murata; Manufacturer Part Number: GRM188R61A106ME69; Approx Volume Cost ($): 0.03; VALUE: 10U; Part Number: GEN-03-0043; Dielectric: X5R; Rated Voltage: 10V; Tolerance: 20%
C37 = STD-06-0034: CHIP CAPACITOR, CERAMIC, 470PF, 50V, 10%, X7R, 0402; Manufacturer: Yageo; Manufacturer Part Number: CC0402KRX7R9BB471; Approx Volume Cost ($): 0.002; VALUE: 470P; Part Number: STD-06-0034; Dielectric: X7R; Rated Voltage: 50V; Tolerance: 10%; Web Search Link: http://www.google.com/search?q=CC0402KRX7R9BB471
D1 D3 = GEN-17-0007: LED, Top View, RED/GREEN, SMD, 0606; Manufacturer: Lite-On; Approx Volume Cost ($): 0.1; VALUE: LTST-C195KGJRKT; Part Number: GEN-17-0007; Manufacturer Part Number: LTST-C195KGJRKT
D2 = GEN-16-0048: ESD Protection Diode Array, 0.6pF, SC-70-6 (SC-88); Manufacturer: ON Semiconductor; Manufacturer Part Number: NUP4114UCLW1T2G; Approx Volume Cost ($): 0.1; VALUE: NUP4114; Part Number: GEN-16-0048; Web Search Link: http://www.google.com/search?q=NUP4114UCLW1T2G
F1 = GEN-21-0009: PTC Fuse, SMD, 0.35A hold, 0.75A trip, 6V, 0805; Manufacturer: Bel Fuse; Manufacturer Part Number: 0ZCK0035FF2G; Max Resistance (R1max): 1.2R; Approx Volume Cost ($): 0.07; VALUE: 0.35A; Part Number: GEN-21-0009; Hold Current: 0.35A; Trip Current: 0.75A; Max Voltage: 6V; Link: https://www.google.com/search?q=Bel Fuse 0ZCK0035FF2G
FB1 = GEN-04-0018: Ferrite Bead, 220R AT 100MHz, For Power Lines, AEC-Q200, 0603, 2.2A; Manufacturer: Murata; Manufacturer Part Number: BLM18KG221BH1; Max DCR: 0.05R; Approx Volume Cost ($): 0.022; VALUE: 220R; Part Number: GEN-04-0018; Web Search Link: http://www.google.com/search?q=BLM18KG221BH1
FB2 = GEN-04-0019: Ferrite Bead, 1000R AT 100MHz, For Signal Lines, 0402, 0.25A; Manufacturer: Murata; Manufacturer Part Number: BLM15HD102SN1; Max DCR: 1.25R; Approx Volume Cost ($): 0.018; VALUE: 1000R; Part Number: GEN-04-0019; Web Search Link: http://www.google.com/search?q=BLM15HD102SN1
J2 = GEN-01-0020: USB Micro B Receptacle, Right Angle, SMD w/2 DIP Legs; Manufacturer: FCI; Manufacturer Part Number: 10118193-0001LF; Approx Volume Cost ($): 0.19; VALUE: 10118193; Part Number: GEN-01-0020
J5 = GEN-24-0021: Connectorless Tag Connect Footprint, 6 pin, No Legs; Manufacturer: NA; VALUE: TAG_CONNECT_6_NL; Part Number: GEN-24-0021; Manufacturer Part Number: NA; Approx Volume Cost ($): NA
L1 = GEN-05-0025: Power Inductor, 1.5uH, 2.6A, 65mR DCR, 2.5x2.0x1.2mm, SMD; Manufacturer: Taiyo Yuden; Manufacturer Part Number: MAMK2520H1R5M; Tolerance: 20%; Max DC Resistance: 0.065R; Rated Current (Saturation): 3.3A; Approx Volume Cost ($): 0.096; VALUE: 1U5; Part Number: GEN-05-0025; Rated Current (Temp Rise): 2.6A; Web Search Link: http://www.google.com/search?q=MAMK2520H1R5M
R1 = STD-09-0014: CHIP RESISTOR ARRAY, 4 ELEMENT, 470 OHM, 63mW, 5%, 0804; Manufacturer: Yageo; Manufacturer Part Number: YC124-JR-07470RL; Max Voltage: 25V; Temperature Coefficient: ±200ppm/°C; Approx Volume Cost ($): 0.007; VALUE: 470R; Part Number: STD-09-0014; Tolerance: 5%; Max Power: 63mW
R2 R7-R10 R22 = STD-01-0072: CHIP RESISTOR, 4.7K OHM, 63mW, 1%, 0402; Manufacturer: Yageo; Manufacturer Part Number: RC0402FR-074K7L; Max Voltage: 50V; Temperature Coefficient: ±100ppm/°C; Approx Volume Cost ($): 0.002; VALUE: 4K7; Part Number: STD-01-0072; Tolerance: 1%; Max Power: 63mW
R3 R14 = GEN-02-0026: CHIP RESISTOR ARRAY, 4 ELEMENT, 36 OHM, 63mW, 5%, 0804; Manufacturer: Panasonic; Manufacturer Part Number: EXB-28V360JX; Max Voltage: 50V; Temperature Coefficient: ±200ppm/°C; Approx Volume Cost ($): 0.008; VALUE: 36R; Part Number: GEN-02-0026; Tolerance: 5%; Max Power: 63mW
R4 R5 R11 R16 R17 R29 = STD-01-0080: CHIP RESISTOR, 10K OHM, 63mW, 1%, 0402; Manufacturer: Yageo; Manufacturer Part Number: RC0402FR-0710KL; Max Voltage: 50V; Temperature Coefficient: ±100ppm/°C; Approx Volume Cost ($): 0.002; VALUE: 10K; Part Number: STD-01-0080; Tolerance: 1%; Max Power: 63mW
R6 = STD-09-0026: CHIP RESISTOR ARRAY, 4 ELEMENT, 47K OHM, 63mW, 5%, 0804; Manufacturer: Yageo; Manufacturer Part Number: YC124-JR-0747KL; Max Voltage: 25V; Temperature Coefficient: ±200ppm/°C; Approx Volume Cost ($): 0.007; VALUE: 47K; Part Number: STD-09-0026; Tolerance: 5%; Max Power: 63mW
R19 = STD-01-0128: CHIP RESISTOR, 1.0M OHM, 63mW, 5%, 0402; Manufacturer: Yageo; Manufacturer Part Number: RC0402JR-071ML; Max Voltage: 50V; Temperature Coefficient: ±100ppm/°C; Approx Volume Cost ($): 0.002; VALUE: 1M; Part Number: STD-01-0128; Tolerance: 5%; Max Power: 63mW
R21 = STD-01-0052: CHIP RESISTOR, 680 OHM, 63mW, 1%, 0402; Manufacturer: Yageo; Manufacturer Part Number: RC0402FR-07680RL; Max Voltage: 50V; Temperature Coefficient: ±100ppm/°C; Approx Volume Cost ($): 0.002; VALUE: 680R; Part Number: STD-01-0052; Tolerance: 1%; Max Power: 63mW
R26 R28 = STD-01-0096: CHIP RESISTOR, 47K OHM, 63mW, 1%, 0402; Manufacturer: Yageo; Manufacturer Part Number: RC0402FR-0747KL; Max Voltage: 50V; Temperature Coefficient: ±100ppm/°C; Approx Volume Cost ($): 0.002; VALUE: 47K; Part Number: STD-01-0096; Tolerance: 1%; Max Power: 63mW
R30 = STD-01-0087: CHIP RESISTOR, 20K OHM, 63mW, 1%, 0402; Manufacturer: Yageo; Manufacturer Part Number: RC0402FR-0720KL; Max Voltage: 50V; Temperature Coefficient: ±100ppm/°C; Approx Volume Cost ($): 0.002; VALUE: 20K; Part Number: STD-01-0087; Tolerance: 1%; Max Power: 63mW
R31 = STD-01-0108: CHIP RESISTOR, 150K OHM, 63mW, 1%, 0402; Manufacturer: Yageo; Manufacturer Part Number: RC0402FR-07150KL; Max Voltage: 50V; Temperature Coefficient: ±100ppm/°C; Approx Volume Cost ($): 0.002; VALUE: 150K; Part Number: STD-01-0108; Tolerance: 1%; Max Power: 63mW; Web Search Link: http://www.google.com/search?q=RC0402FR-07150KL
TP1 = GEN-24-0003: Testpoint, SMD, 1mm; Manufacturer: NA; VALUE: TESTPOINT; Part Number: GEN-24-0003; Manufacturer Part Number: NA; Approx Volume Cost ($): NA
TP3 TP4 TP6-TP15 = GEN-24-0014: Testpoint, SMD, 1.2mm; Manufacturer: NA; VALUE: TESTPOINT; Part Number: GEN-24-0014; Manufacturer Part Number: NA; Approx Volume Cost ($): NA
U1 = GEN-12-0023: Memory, Flash, SPI, Multi-IO, 8Mb (4Kx256), 1.65V to 1.95V, USON-8 (2x3mm); Manufacturer: Winbond; Manufacturer Part Number: W25Q80EWUXIE; Approx Volume Cost ($): 0.38; VALUE: W25Q80EW; Part Number: GEN-12-0023
U2 U4 = GEN-11-0017: Configurable Dual-Voltage Supply Translator, 4 bit, DQFN16; Manufacturer: Fairchild; Manufacturer Part Number: FXL4TD245BQX; Approx Volume Cost ($): 0.5; VALUE: FXL4TD245; Part Number: GEN-11-0017; Web Search Link: http://www.google.com/search?q=FXL4TD245BQX
U3 = GEN-08-0033: Processor, xcore.ai, 2400MIPS, 1.8V VDDIO, 60QFN; Manufacturer: XMOS; Approx Volume Cost ($): 1; VALUE: XU316-1024-QF60A-C24; Part Number: GEN-08-0033; Manufacturer Part Number: XU316-1024-QF60A-C24; Web Search Link: http://www.google.com/search?q=XU316-1024-QF60A
U5 = GEN-11-0049: Single Buffer with 3-State Output, LVC Series, SON6; Manufacturer: Texas Instruments; Manufacturer Part Number: SN74LVC1G125DRYR; Approx Volume Cost ($): 0.14; VALUE: SN74LVC1G125; Part Number: GEN-11-0049; Web Search Link: http://www.google.com/search?q=SN74LVC1G125DRYR
U6 = GEN-14-0057: Voltage Regulator, Dual, 3.3V/1.8V, 150mA, Low Iq, Low Dropout, X2SON-6; Manufacturer: Texas Instruments; Manufacturer Part Number: TLV7163318PDPQR; Op Temp Range: TJ = -40 to 125; Approx Volume Cost ($): 0.13; VALUE: TLV7163318P; Part Number: GEN-14-0057
U7 = GEN-14-0064: DC-DC Synchronous Buck Converter, Adjustable, PFM/PWM, Power Good, 2.2MHz, 1A, SOT563; Manufacturer: Diodes Incorporated; Manufacturer Part Number: AP61102Z6-7; Op Temp Range: TJ = -40 to 125; Approx Volume Cost ($): 0.11; VALUE: AP61102; Part Number: GEN-14-0064; Web Search Link: http://www.google.com/search?q=AP61102Z6-7
X1 = GEN-15-0038: Crystal, 24MHz, Freq Tol. ±8ppm, Freq Stab. ±12ppm, CL 10pF, Max ESR 70 Ohm, 2.0x1.6mm SMD; Manufacturer: Murata; Manufacturer Part Number: XRCGB24M000FFS1CR0; Approx Volume Cost ($): 0.27; VALUE: XRCGB; Part Number: GEN-15-0038; Web Search Link: http://www.google.com/search?q=XRCGB24M000FFS1CR0

## Sheet DigitalIO.SchDoc: xcore.ai Multi Channel Audio
size 408 x 287 mm; DocumentNumber: 5; Revision: 1V1; SheetNumber: 5; SheetTotal: 8
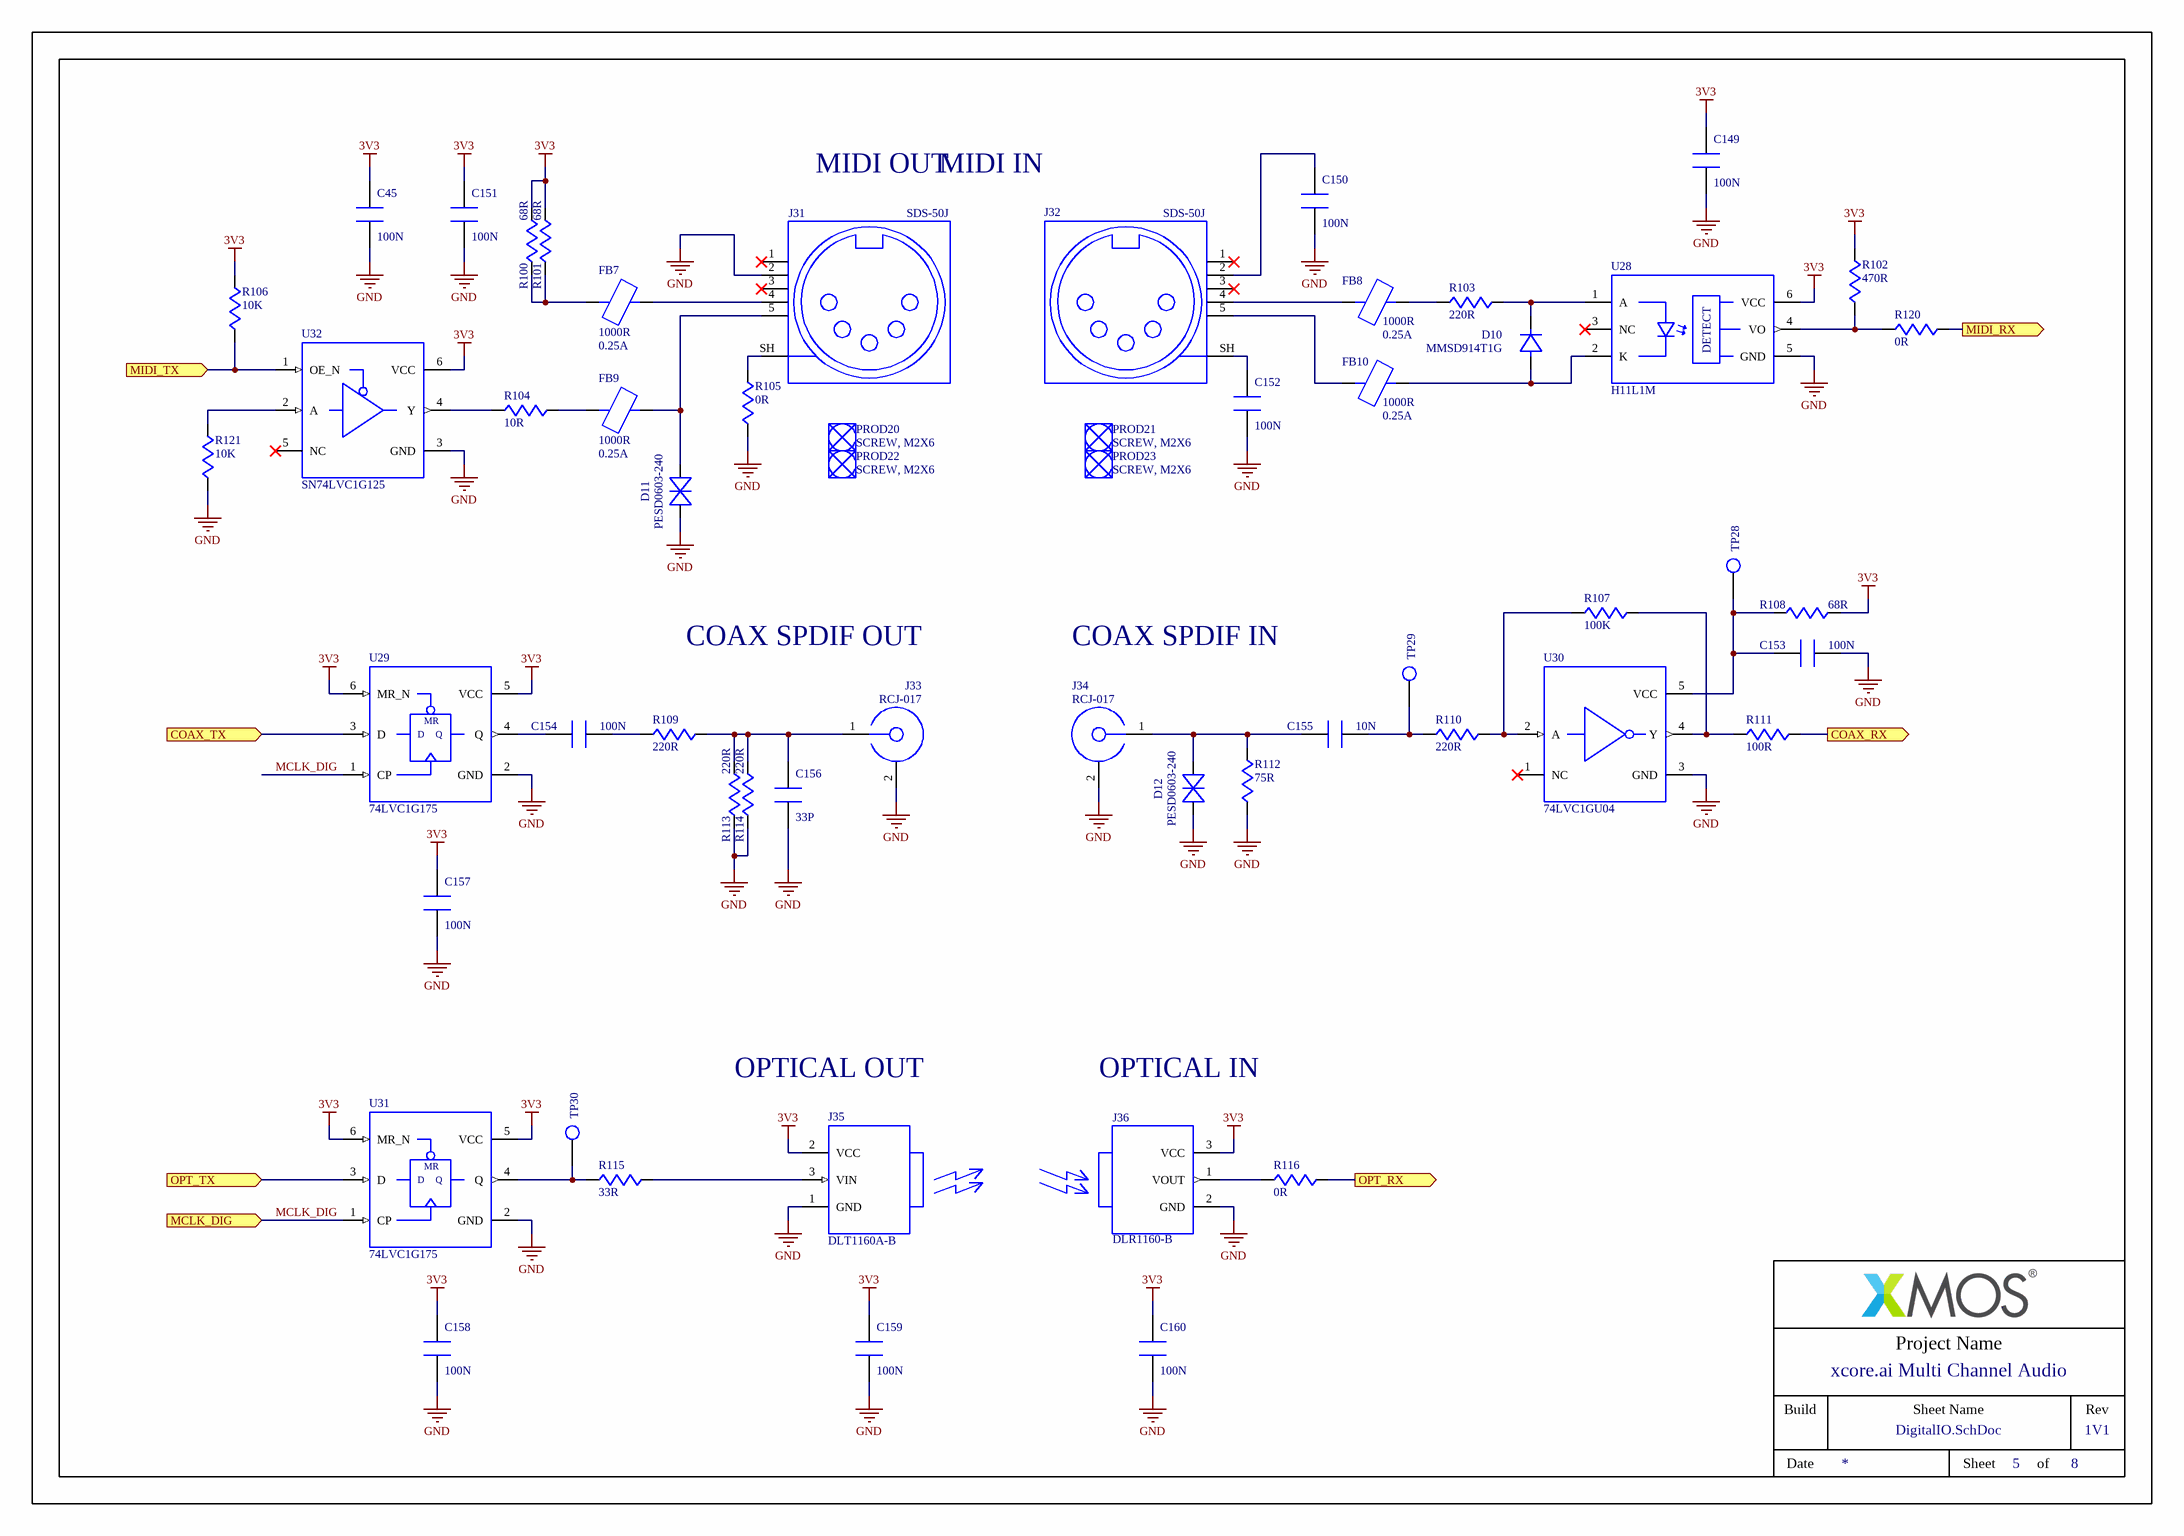
[diagram p8: DigitalIO.SchDoc]

### Parts
C45  100N  [CAPC1005X55N]
C149  100N  [CAPC1005X55N]
C150  100N  [CAPC1608X90N]
C151  100N  [CAPC1005X55N]
C152  100N  [CAPC1608X90N]
C153  100N  [CAPC1005X55N]
C154  100N  [CAPC1005X55N]
C155  10N  [CAPC1005X55N]
C156  33P  [CAPC1005X55N]
C157  100N  [CAPC1005X55N]
C158  100N  [CAPC1005X55N]
C159  100N  [CAPC1005X55N]
C160  100N  [CAPC1005X55N]
D10  MMSD914T1G  [SOD3716X135N]
D11  PESD0603-240  [RESC1608X55N]
D12  PESD0603-240  [RESC1608X55N]
FB7  1000R  Rated Current: 0.25A  [INDC1005X55N]
FB8  1000R  Rated Current: 0.25A  [INDC1005X55N]
FB9  1000R  Rated Current: 0.25A  [INDC1005X55N]
FB10  1000R  Rated Current: 0.25A  [INDC1005X55N]
J31  SDS-50J  [DIN_5PIN_180_RA]
J32  SDS-50J  [DIN_5PIN_180_RA]
J33  RCJ-017  [CON_CUI_RCJ_017]
J34  RCJ-017  [CON_CUI_RCJ_017]
J35  DLT1160A-B  [CON_OPT_AIXIN_DLX1160]
J36  DLR1160-B  [CON_OPT_AIXIN_DLX1160]
PROD20  SCREW, M2X6  (mechanical)
PROD21  SCREW, M2X6  (mechanical)
PROD22  SCREW, M2X6  (mechanical)
PROD23  SCREW, M2X6  (mechanical)
R100  68R  [RESC3116X65N]
R101  68R  [RESC3116X65N]
R102  470R  [RESC1608X55N]
R103  220R  [RESC3116X65N]
R104  10R  [RESC3116X65N]
R105  0R  [RESC1608X55N]
R106  10K  [RESC1608X55N]
R107  100K  [RESC1608X55N]
R108  68R  [RESC1608X55N]
R109  220R  [RESC1608X55N]
R110  220R  [RESC1608X55N]
R111  100R  [RESC1608X55N]
R112  75R  [RESC3116X65N]
R113  220R  [RESC1608X55N]
R114  220R  [RESC1608X55N]
R115  33R  [RESC1608X55N]
R116  0R  [RESC1608X55N]
R120  0R  [RESC1608X55N]
R121  10K  [RESC1608X55N]
TP28  TESTPOINT  [TESTPOINT_SMD_1MM]  (value not drawn)  (no BOM)
TP29  TESTPOINT  [TESTPOINT_SMD_1MM]  (value not drawn)  (no BOM)
TP30  TESTPOINT  [TESTPOINT_SMD_1MM]  (value not drawn)  (no BOM)
U28  H11L1M  [IC_ONSEMI_PDIP6_646BY]
U29  74LVC1G175  [SOT95P280X145-6N]
U30  74LVC1GU04  [SOT23-5P95_275X110L40X37N]
U31  74LVC1G175  [SOT95P280X145-6N]
U32  SN74LVC1G125  [TI_R_PUSON_N6]

### Ports
COAX_RX (out), COAX_TX (in), MCLK_DIG (in), MIDI_RX (out), MIDI_TX (in), OPT_RX (out), OPT_TX (in)

### Nets
3V3: C45.1 C149.1 C151.1 C157.1 C158.1 C159.1 C160.1 J35.2(VCC) J36.3(VCC) R100.2 R101.2 R102.2 R106.2 R108.1 U28.6(VCC) U29.5(VCC) U29.6(MR_N) U31.5(VCC) U31.6(MR_N) U32.6(VCC)
GND: C45.2 C149.2 C150.2 C151.2 C152.2 C153.2 C156.2 C157.2 C158.2 C159.2 C160.2 D11.1 D12.1 J31.2 J33.2 J34.2 J35.1(GND) J36.2(GND) R105.1 R112.1 R113.1 R114.1 R121.1 U28.5(GND) U29.2(GND) U30.3(GND) U31.2(GND) U32.3(GND)
COAX_RX: R111.2 ; port COAX_RX
COAX_TX: U29.3(D) ; port COAX_TX
MCLK_DIG: U29.1(CP) U31.1(CP) ; port MCLK_DIG
MIDI_RX: R120.2 ; port MIDI_RX
MIDI_TX: R106.1 U32.1(OE_N) ; port MIDI_TX
OPT_RX: R116.2 ; port OPT_RX
OPT_TX: U31.3(D) ; port OPT_TX
NetC150_1: C150.1 J32.2
NetC152_1: C152.1 J32.SH(SHIELD)
NetC153_1: C153.1 R108.2 TP28.1 U30.5(VCC)
NetC154_1: C154.1 U29.4(Q)
NetC154_2: C154.2 R109.1
NetC155_1: C155.1 D12.2 J34.1 R112.2
NetC155_2: C155.2 R110.1 TP29.1
NetC156_1: C156.1 J33.1 R109.2 R113.2 R114.2
NetD10_1: D10.1(K) R103.2 U28.1(A)
NetD10_2: D10.2(A) FB10.2 U28.2(K)
NetD11_2: D11.2 FB9.1 J31.5
NetFB7_1: FB7.1 J31.4
NetFB7_2: FB7.2 R100.1 R101.1
NetFB8_1: FB8.1 J32.4
NetFB8_2: FB8.2 R103.1
NetFB9_2: FB9.2 R104.2
NetFB10_1: FB10.1 J32.5
NetJ31_SH: J31.SH(SHIELD) R105.2
NetJ35_3: J35.3(VIN) R115.2
NetJ36_1: J36.1(VOUT) R116.1
NetR102_1: R102.1 R120.1 U28.4(VO)
NetR104_1: R104.1 U32.4(Y)
NetR107_1: R107.1 R110.2 U30.2(A)
NetR107_2: R107.2 R111.1 U30.4(Y)
NetR115_1: R115.1 TP30.1 U31.4(Q)
NetR121_2: R121.2 U32.2(A)

Not connected (* = marked no-connect by the designer): J31 1* 3*; J32 1* 3*; U28 3(NC)*; U30 1(NC)*; U32 5(NC)*

### Notes on the sheet
- MIDI OUT
- MIDI IN
- COAX SPDIF OUT
- COAX SPDIF IN
- OPTICAL OUT
- OPTICAL IN
- Project Name
- Build
- Sheet Name
- Rev
- Date
- Sheet
- of
- (in symbol GEN-11-0051) MR
- (in symbol GEN-13-0028) DETECT

### Library data of the parts
C45 C149 C151 C153 C154 C157-C160 = STD-06-0048: as C1-C4 on sheet XTAG4; VALUE: 100N; Part Number: STD-06-0048; Dielectric: X7R; Rated Voltage: 16V; Tolerance: 10%; Web Search Link: http://www.google.com/search?q=CC0402KRX7R7BB104
C150 C152 = STD-06-0073: CHIP CAPACITOR, CERAMIC, 100NF, 50V, 10%, X7R, 0603; Manufacturer: Yageo; Manufacturer Part Number: CC0603KRX7R9BB104; Approx Volume Cost ($): 0.002; VALUE: 100N; Part Number: STD-06-0073; Dielectric: X7R; Rated Voltage: 50V; Tolerance: 10%; Web Search Link: http://www.google.com/search?q=CC0603KRX7R9BB104
C155 = STD-06-0042: CHIP CAPACITOR, CERAMIC, 10NF, 50V, 10%, X7R, 0402; Manufacturer: Yageo; Manufacturer Part Number: CC0402KRX7R9BB103; Approx Volume Cost ($): 0.002; VALUE: 10N; Part Number: STD-06-0042; Dielectric: X7R; Rated Voltage: 50V; Tolerance: 10%; Web Search Link: http://www.google.com/search?q=CC0402KRX7R9BB103
C156 = STD-06-0019: CHIP CAPACITOR, CERAMIC, 33PF, 50V, 5%, NP0, 0402; Manufacturer: Yageo; Manufacturer Part Number: CC0402JRNPO9BN330; Approx Volume Cost ($): 0.003; VALUE: 33P; Part Number: STD-06-0019; Dielectric: NP0; Rated Voltage: 50V; Tolerance: 5%; Web Search Link: http://www.google.com/search?q=CC0402JRNPO9BN330
D10 = GEN-16-0055: Diode, 100V, 0.2A, SOD123; Manufacturer: ON Semiconductor; Approx Volume Cost ($): 0.04; VALUE: MMSD914T1G; Part Number: GEN-16-0055; Manufacturer Part Number: MMSD914T1G; Web Search Link: http://www.google.com/search?q=MMSD914T1G
D11 D12 = GEN-16-0011: Polymer ESD Protection Device, 24V Stand-Off, 0.25pF, 0603; Manufacturer: Tyco; Approx Volume Cost ($): 0.12; VALUE: PESD0603-240; Part Number: GEN-16-0011; Manufacturer Part Number: PESD0603-240; Web Search Link: http://www.google.com/search?q=PESD0603-240
FB7-FB10 = GEN-04-0019: as FB2 on sheet XTAG4; VALUE: 1000R; Part Number: GEN-04-0019; Web Search Link: http://www.google.com/search?q=BLM15HD102SN1
J31 J32 = GEN-01-0123: Standard DIN Connector, 5 Pin, 180 degrees, PCB Mount, Right Angle, Through Hole; Manufacturer: CUI; Approx Volume Cost ($): 0.78; VALUE: SDS-50J; Part Number: GEN-01-0123; Manufacturer Part Number: SDS-50J; Web Search Link: http://www.google.com/search?q=SDS-50J
J33 J34 = GEN-01-0124: RCA Jack, Right Angle, Orange, Through Hole; Manufacturer: CUI; Approx Volume Cost ($): 0.47; VALUE: RCJ-017; Part Number: GEN-01-0124; Manufacturer Part Number: RCJ-017; Web Search Link: http://www.google.com/search?q=RCJ-017
J35 = GEN-01-0119: Optical Digital Audio Transmitter, Black Shutter, 16Mbps max, 2.7-5.5V, Through Hole; Manufacturer: Aixin Opto-Electrical Technology; Approx Volume Cost ($): 0.5; VALUE: DLT1160A-B; Part Number: GEN-01-0119; Manufacturer Part Number: DLT1160A-B; Web Search Link: http://www.google.com/search?q=DLT1160A
J36 = GEN-01-0120: Optical Digital Audio Receiver, Black Shutter, 16Mbps max, 2.7-5.5V, Through Hole; Manufacturer: Aixin Opto-Electrical Technology; Approx Volume Cost ($): 0.5; VALUE: DLR1160-B; Part Number: GEN-01-0120; Manufacturer Part Number: DLR1160-B; Web Search Link: http://www.google.com/search?q=DLR1160
PROD20-PROD23 = GEN-23-0012: Machine screw, M2 thread, 6mm length, Steel, BZP, Pan head Pozidriv; Manufacturer: TR Fastenings; Manufacturer Part Number: M2 6 PRSTMC Z100; Approx Volume Cost ($): 0.03; VALUE: SCREW, M2X6; Part Number: GEN-23-0012; Web Search Link: http://www.google.com/search?q=M2 6 PRSTMC Z100
R100 R101 = STD-05-0034: CHIP RESISTOR, 68 OHM, 0.25W, 1%, 1206; Manufacturer: Yageo; Manufacturer Part Number: RC1206FR-0768RL; Max Voltage: 200V; Max Power: 250mW; Temperature Coefficient: ±100ppm/°C; Approx Volume Cost ($): 0.004; VALUE: 68R; Part Number: STD-05-0034; Tolerance: 1%; Web Search Link: http://www.google.com/search?q=RC1206FR-0768RL
R102 = STD-02-0054: CHIP RESISTOR, 470 OHM, 0.1W, 1%, 0603; Manufacturer: Yageo; Manufacturer Part Number: RC0603FR-07470RL; Max Voltage: 50V; Max Power: 100mW; Temperature Coefficient: ±100ppm/°C; Approx Volume Cost ($): 0.002; VALUE: 470R; Part Number: STD-02-0054; Tolerance: 1%; Web Search Link: http://www.google.com/search?q=RC0603FR-07470RL
R103 = STD-05-0046: CHIP RESISTOR, 220 OHM, 0.25W, 1%, 1206; Manufacturer: Yageo; Manufacturer Part Number: RC1206FR-07220RL; Max Voltage: 200V; Max Power: 250mW; Temperature Coefficient: ±100ppm/°C; Approx Volume Cost ($): 0.004; VALUE: 220R; Part Number: STD-05-0046; Tolerance: 1%; Web Search Link: http://www.google.com/search?q=RC1206FR-07220RL
R104 = STD-05-0014: CHIP RESISTOR, 10 OHM, 0.25W, 1%, 1206; Manufacturer: Yageo; Manufacturer Part Number: RC1206FR-0710RL; Max Voltage: 200V; Max Power: 250mW; Temperature Coefficient: ±200ppm/°C; Approx Volume Cost ($): 0.004; VALUE: 10R; Part Number: STD-05-0014; Tolerance: 1%; Web Search Link: http://www.google.com/search?q=RC1206FR-0710RL
R105 R116 R120 = STD-02-0001: CHIP RESISTOR, ZERO OHM JUMPER, 1A, 0603; Manufacturer: Yageo; Manufacturer Part Number: RC0603JR-070RL; Tolerance: NA; Max Voltage: 50V; Approx Volume Cost ($): 0.002; VALUE: 0R; Part Number: STD-02-0001; Max Power: NA; Temperature Coefficient: NA; Web Search Link: http://www.google.com/search?q=RC0603JR-070RL
R106 R121 = STD-02-0086: CHIP RESISTOR, 10K OHM, 0.1W, 1%, 0603; Manufacturer: Yageo; Manufacturer Part Number: RC0603FR-0710KL; Max Voltage: 50V; Max Power: 100mW; Temperature Coefficient: ±100ppm/°C; Approx Volume Cost ($): 0.002; VALUE: 10K; Part Number: STD-02-0086; Tolerance: 1%; Web Search Link: http://www.google.com/search?q=RC0603FR-0710KL
R107 = STD-02-0110: CHIP RESISTOR, 100K OHM, 0.1W, 1%, 0603; Manufacturer: Yageo; Manufacturer Part Number: RC0603FR-07100KL; Max Voltage: 50V; Max Power: 100mW; Temperature Coefficient: ±100ppm/°C; Approx Volume Cost ($): 0.002; VALUE: 100K; Part Number: STD-02-0110; Tolerance: 1%; Web Search Link: http://www.google.com/search?q=RC0603FR-07100KL
R108 = STD-02-0034: CHIP RESISTOR, 68 OHM, 0.1W, 1%, 0603; Manufacturer: Yageo; Manufacturer Part Number: RC0603FR-0768RL; Max Voltage: 50V; Max Power: 100mW; Temperature Coefficient: ±100ppm/°C; Approx Volume Cost ($): 0.002; VALUE: 68R; Part Number: STD-02-0034; Tolerance: 1%; Web Search Link: http://www.google.com/search?q=RC0603FR-0768RL
R109 R110 R113 R114 = STD-02-0046: CHIP RESISTOR, 220 OHM, 0.1W, 1%, 0603; Manufacturer: Yageo; Manufacturer Part Number: RC0603FR-07220RL; Max Voltage: 50V; Max Power: 100mW; Temperature Coefficient: ±100ppm/°C; Approx Volume Cost ($): 0.002; VALUE: 220R; Part Number: STD-02-0046; Tolerance: 1%; Web Search Link: http://www.google.com/search?q=RC0603FR-07220RL
R111 = STD-02-0038: CHIP RESISTOR, 100 OHM, 0.1W, 1%, 0603; Manufacturer: Yageo; Manufacturer Part Number: RC0603FR-07100RL; Max Voltage: 50V; Max Power: 100mW; Temperature Coefficient: ±100ppm/°C; Approx Volume Cost ($): 0.002; VALUE: 100R; Part Number: STD-02-0038; Tolerance: 1%; Web Search Link: http://www.google.com/search?q=RC0603FR-07100RL
R112 = STD-05-0035: CHIP RESISTOR, 75 OHM, 0.25W, 1%, 1206; Manufacturer: Yageo; Manufacturer Part Number: RC1206FR-0775RL; Max Voltage: 200V; Max Power: 250mW; Temperature Coefficient: ±100ppm/°C; Approx Volume Cost ($): 0.004; VALUE: 75R; Part Number: STD-05-0035; Tolerance: 1%; Web Search Link: http://www.google.com/search?q=RC1206FR-0775RL
R115 = STD-02-0026: CHIP RESISTOR, 33 OHM, 0.1W, 1%, 0603; Manufacturer: Yageo; Manufacturer Part Number: RC0603FR-0733RL; Max Voltage: 50V; Max Power: 100mW; Temperature Coefficient: ±100ppm/°C; Approx Volume Cost ($): 0.002; VALUE: 33R; Part Number: STD-02-0026; Tolerance: 1%; Web Search Link: http://www.google.com/search?q=RC0603FR-0733RL
TP28-TP30 = GEN-24-0003: Testpoint, SMD, 1mm; Manufacturer: NA; VALUE: TESTPOINT; Part Number: GEN-24-0003; Manufacturer Part Number: NA; Approx Volume Cost ($): NA
U28 = GEN-13-0028: Optocoupler, Schmitt Trigger Output, 3-15V, 1.6mA Turn-On, PDIP6_SMD; Manufacturer: ON Semiconductor; Manufacturer Part Number: H11L1SM; Approx Volume Cost ($): 0.3; VALUE: H11L1M; Part Number: GEN-13-0028; Web Search Link: http://www.google.com/search?q=H11L1SM
U29 U31 = GEN-11-0051: Single D-Type Flip Flop with Reset, Positive Edge Trigger, LVC Series, SOT23-6 (SC-74); Manufacturer: Nexperia; Manufacturer Part Number: 74LVC1G175GV; Approx Volume Cost ($): 0.1; VALUE: 74LVC1G175; Part Number: GEN-11-0051; Web Search Link: http://www.google.com/search?q=74LVC1G175GV
U30 = GEN-11-0047: Single Unbuffered Inverter, LVC Series, SOT23-5; Manufacturer: Nexperia; Manufacturer Part Number: 74LVC1GU04GV; Approx Volume Cost ($): 0.06; VALUE: 74LVC1GU04; Part Number: GEN-11-0047; Web Search Link: http://www.google.com/search?q=74LVC1GU04GV
U32 = GEN-11-0049: as U5 on sheet XTAG4; VALUE: SN74LVC1G125; Part Number: GEN-11-0049; Web Search Link: http://www.google.com/search?q=SN74LVC1G125DRYR